# EAGLE schematic decel_control (EAGLE 9.6.2)
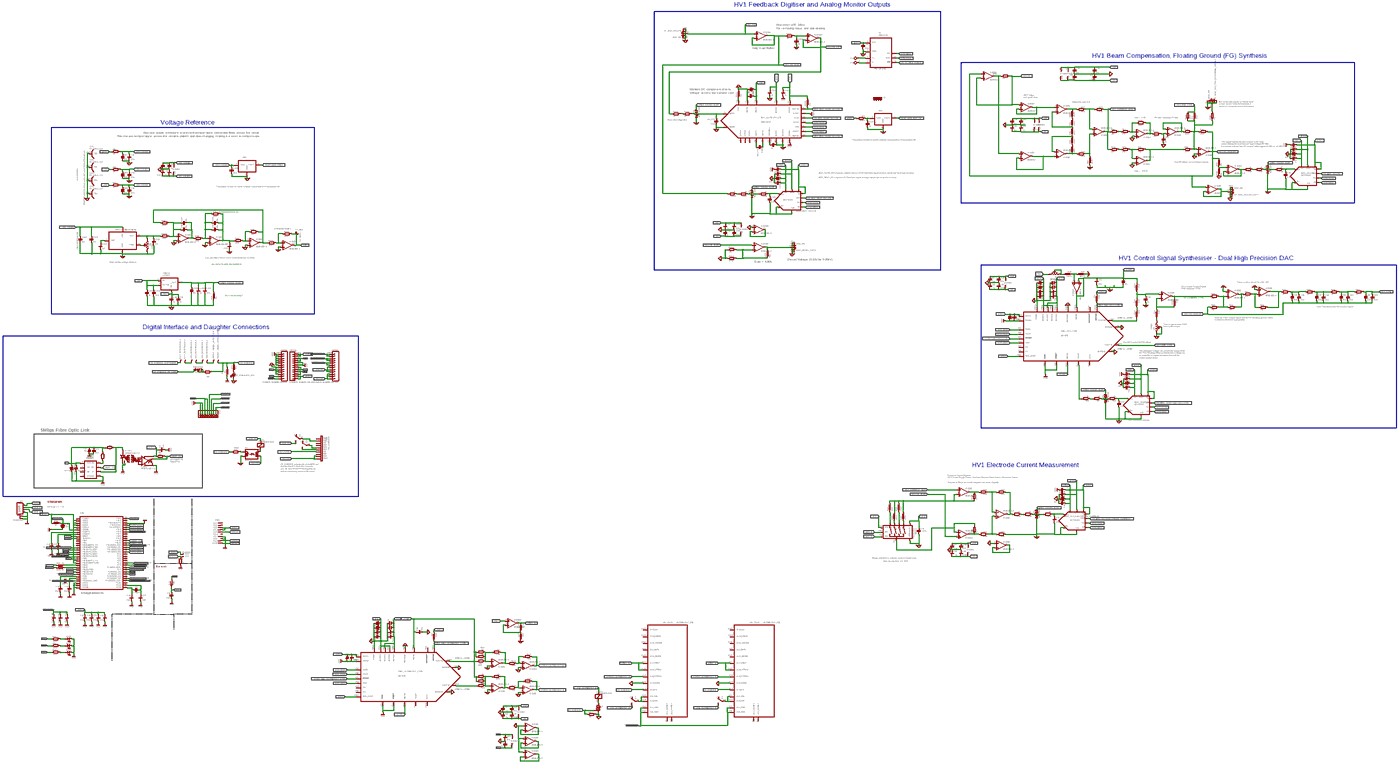
[diagram p0: schematic, sheet 1, overview]
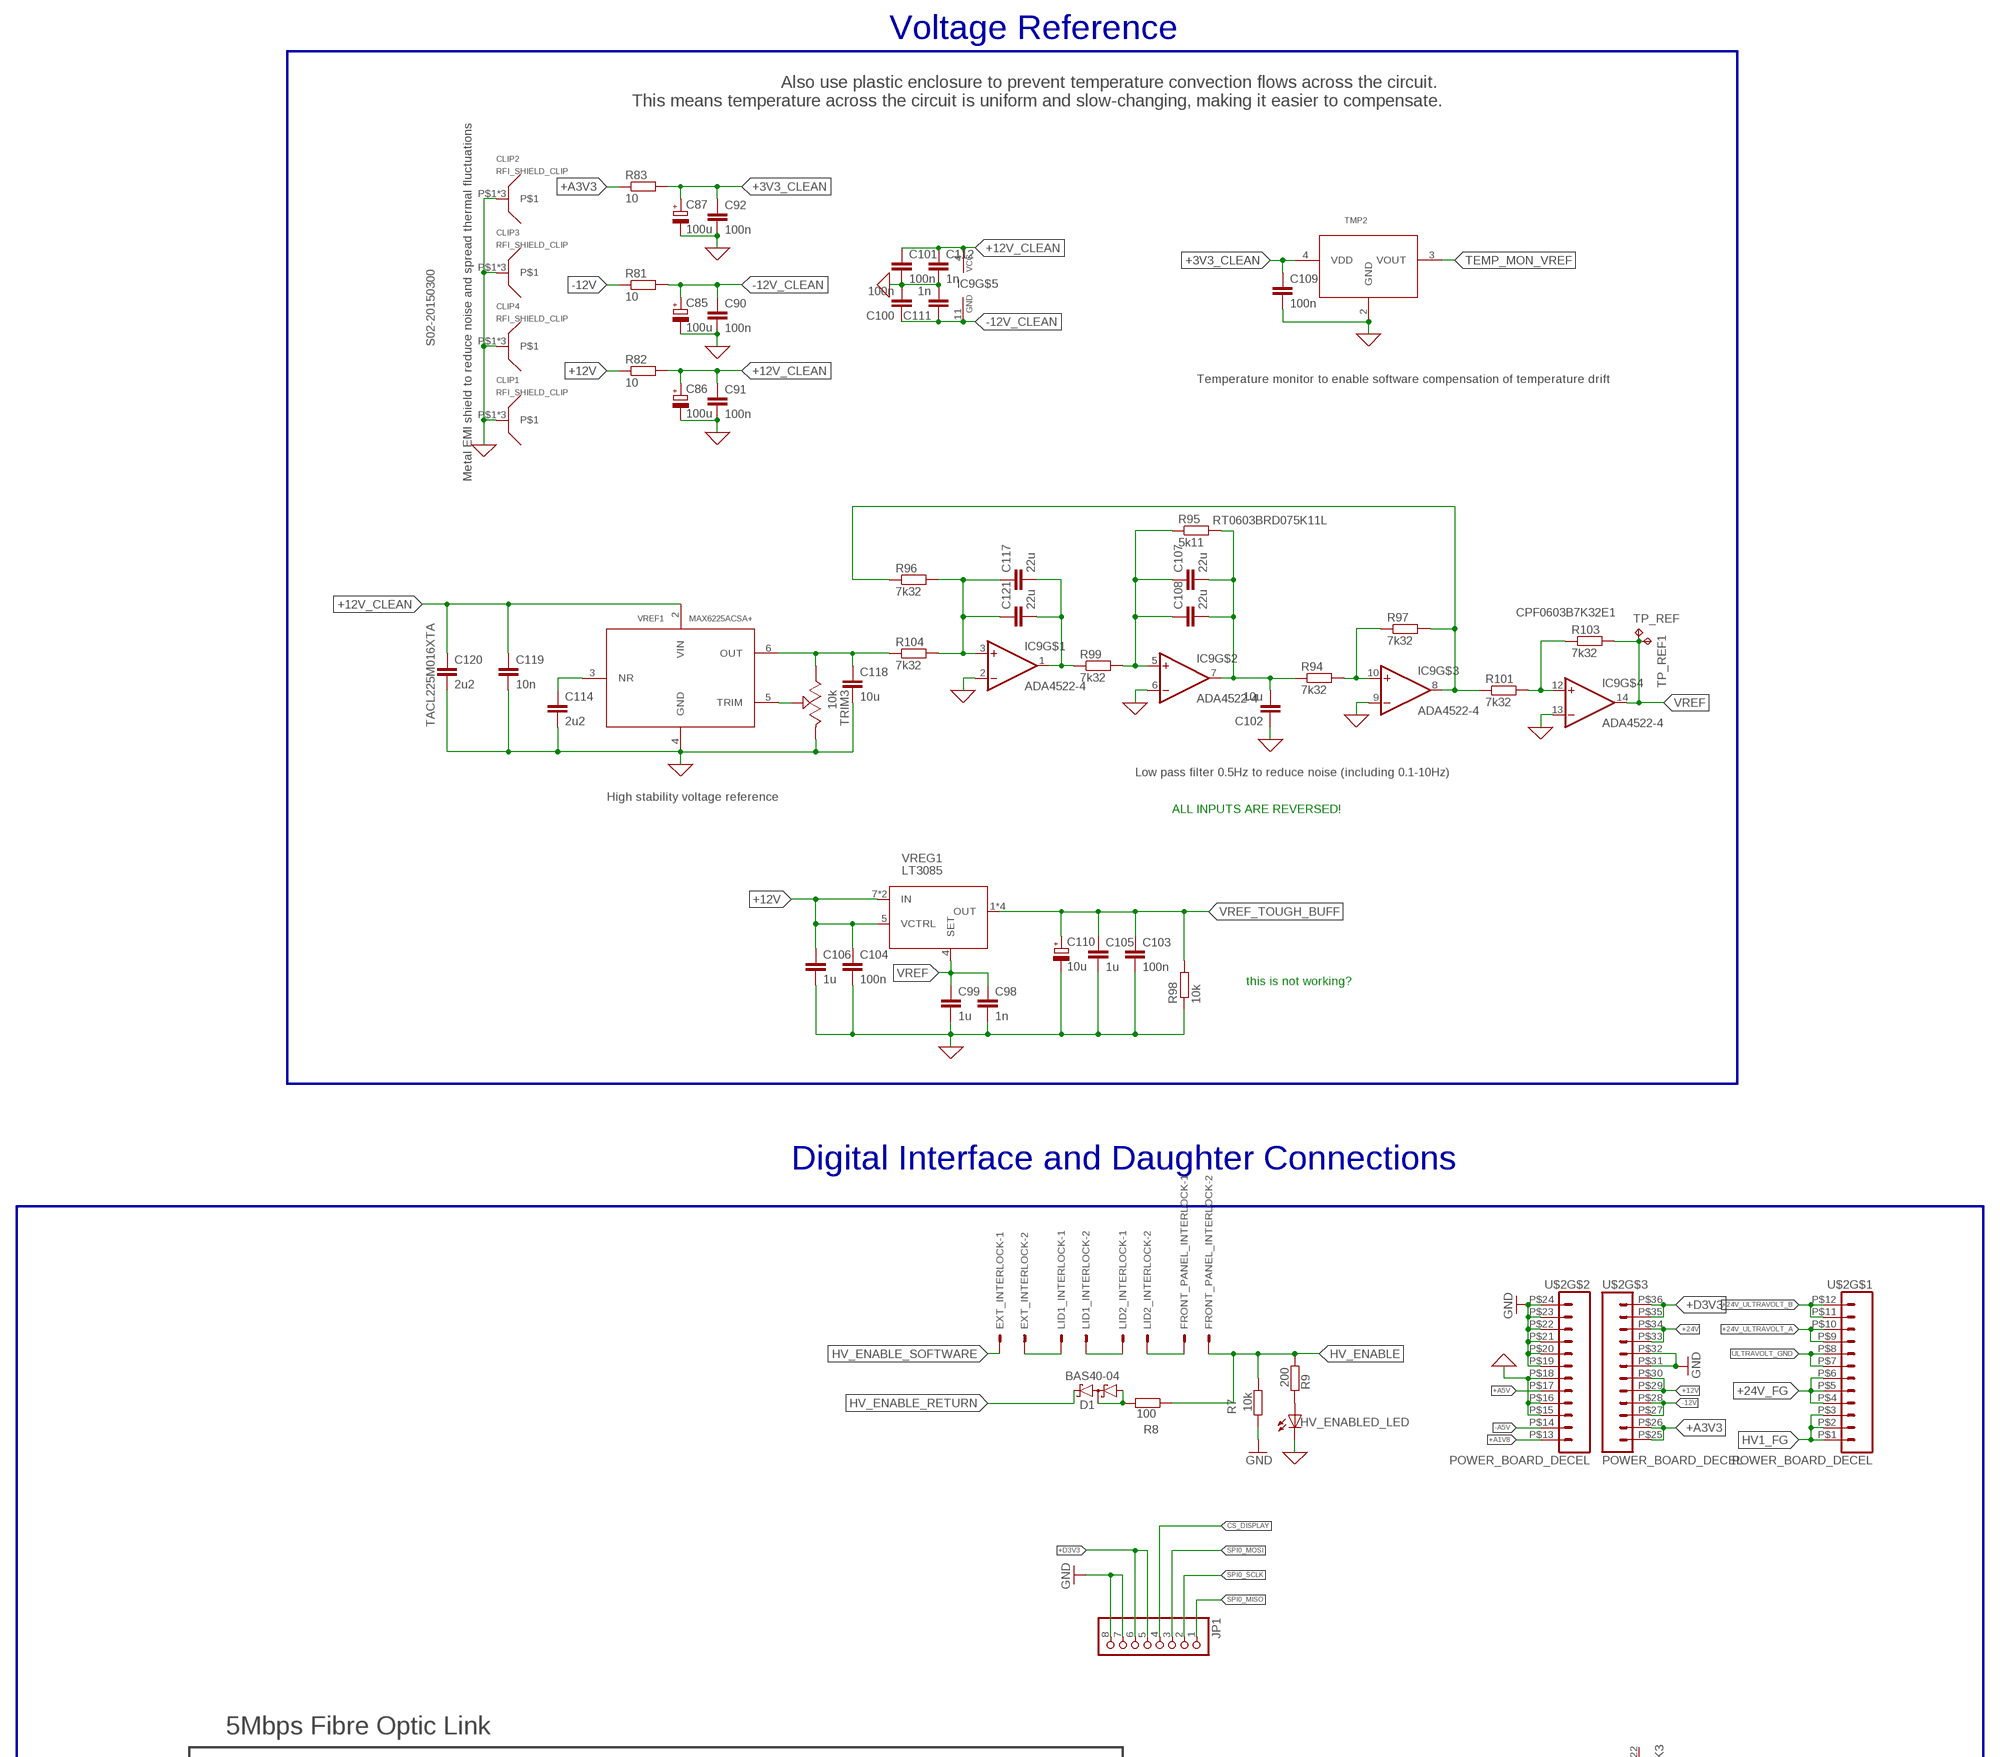
[diagram p1: schematic, sheet 1, part 1 of 7]
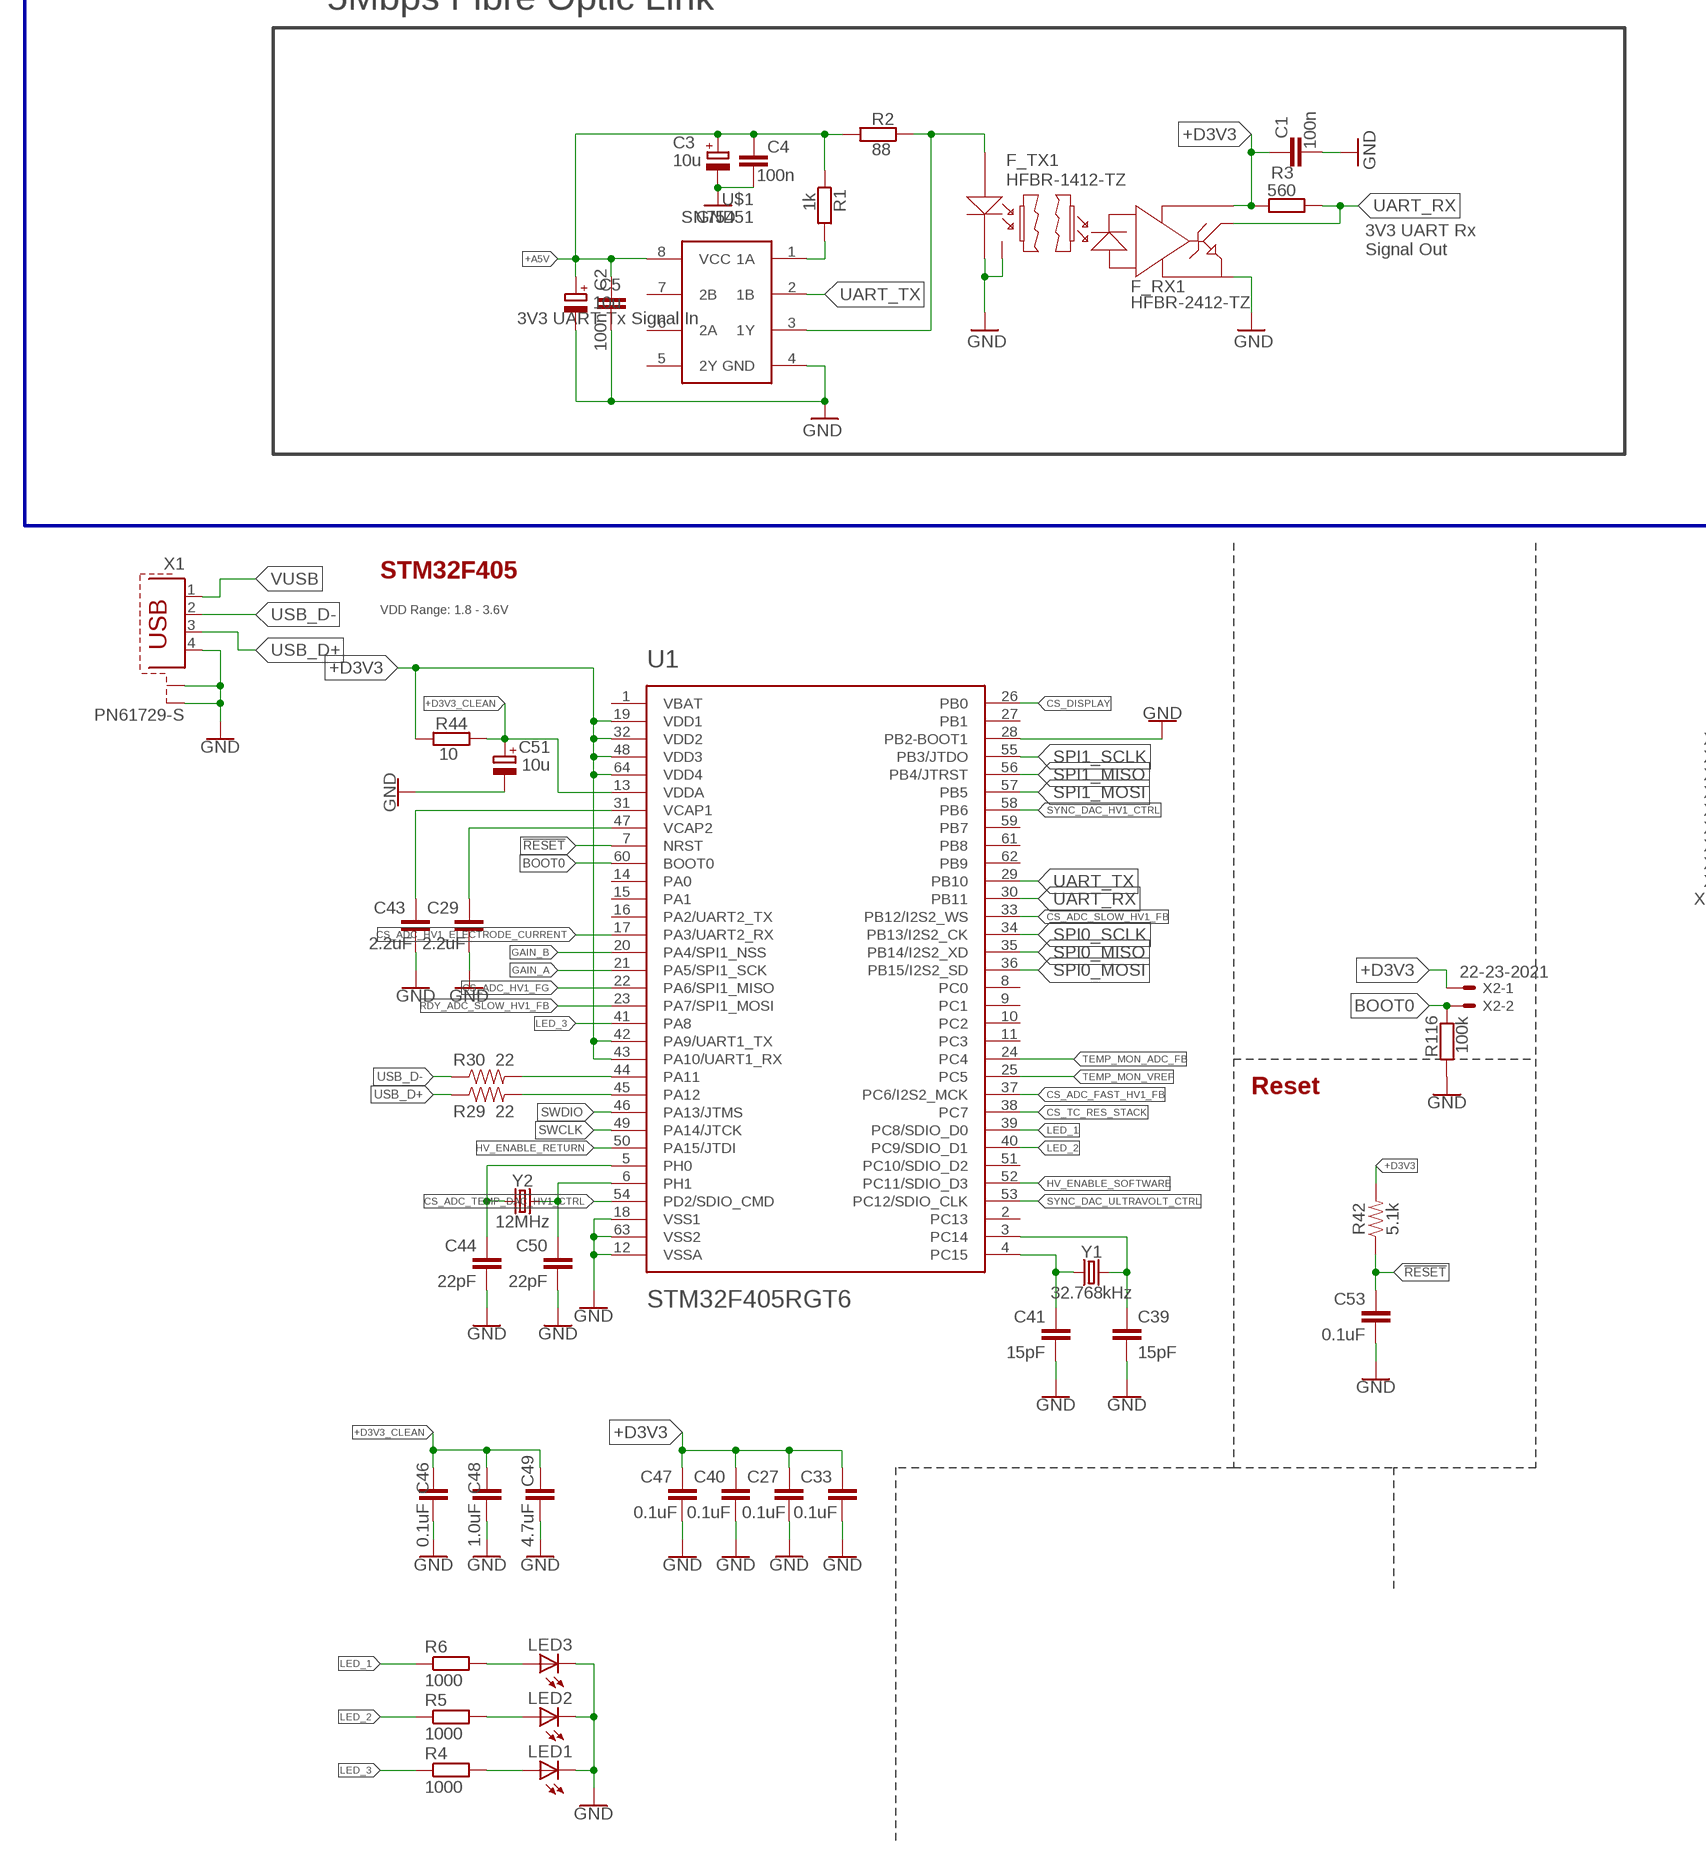
[diagram p2: schematic, sheet 1, part 2 of 7]
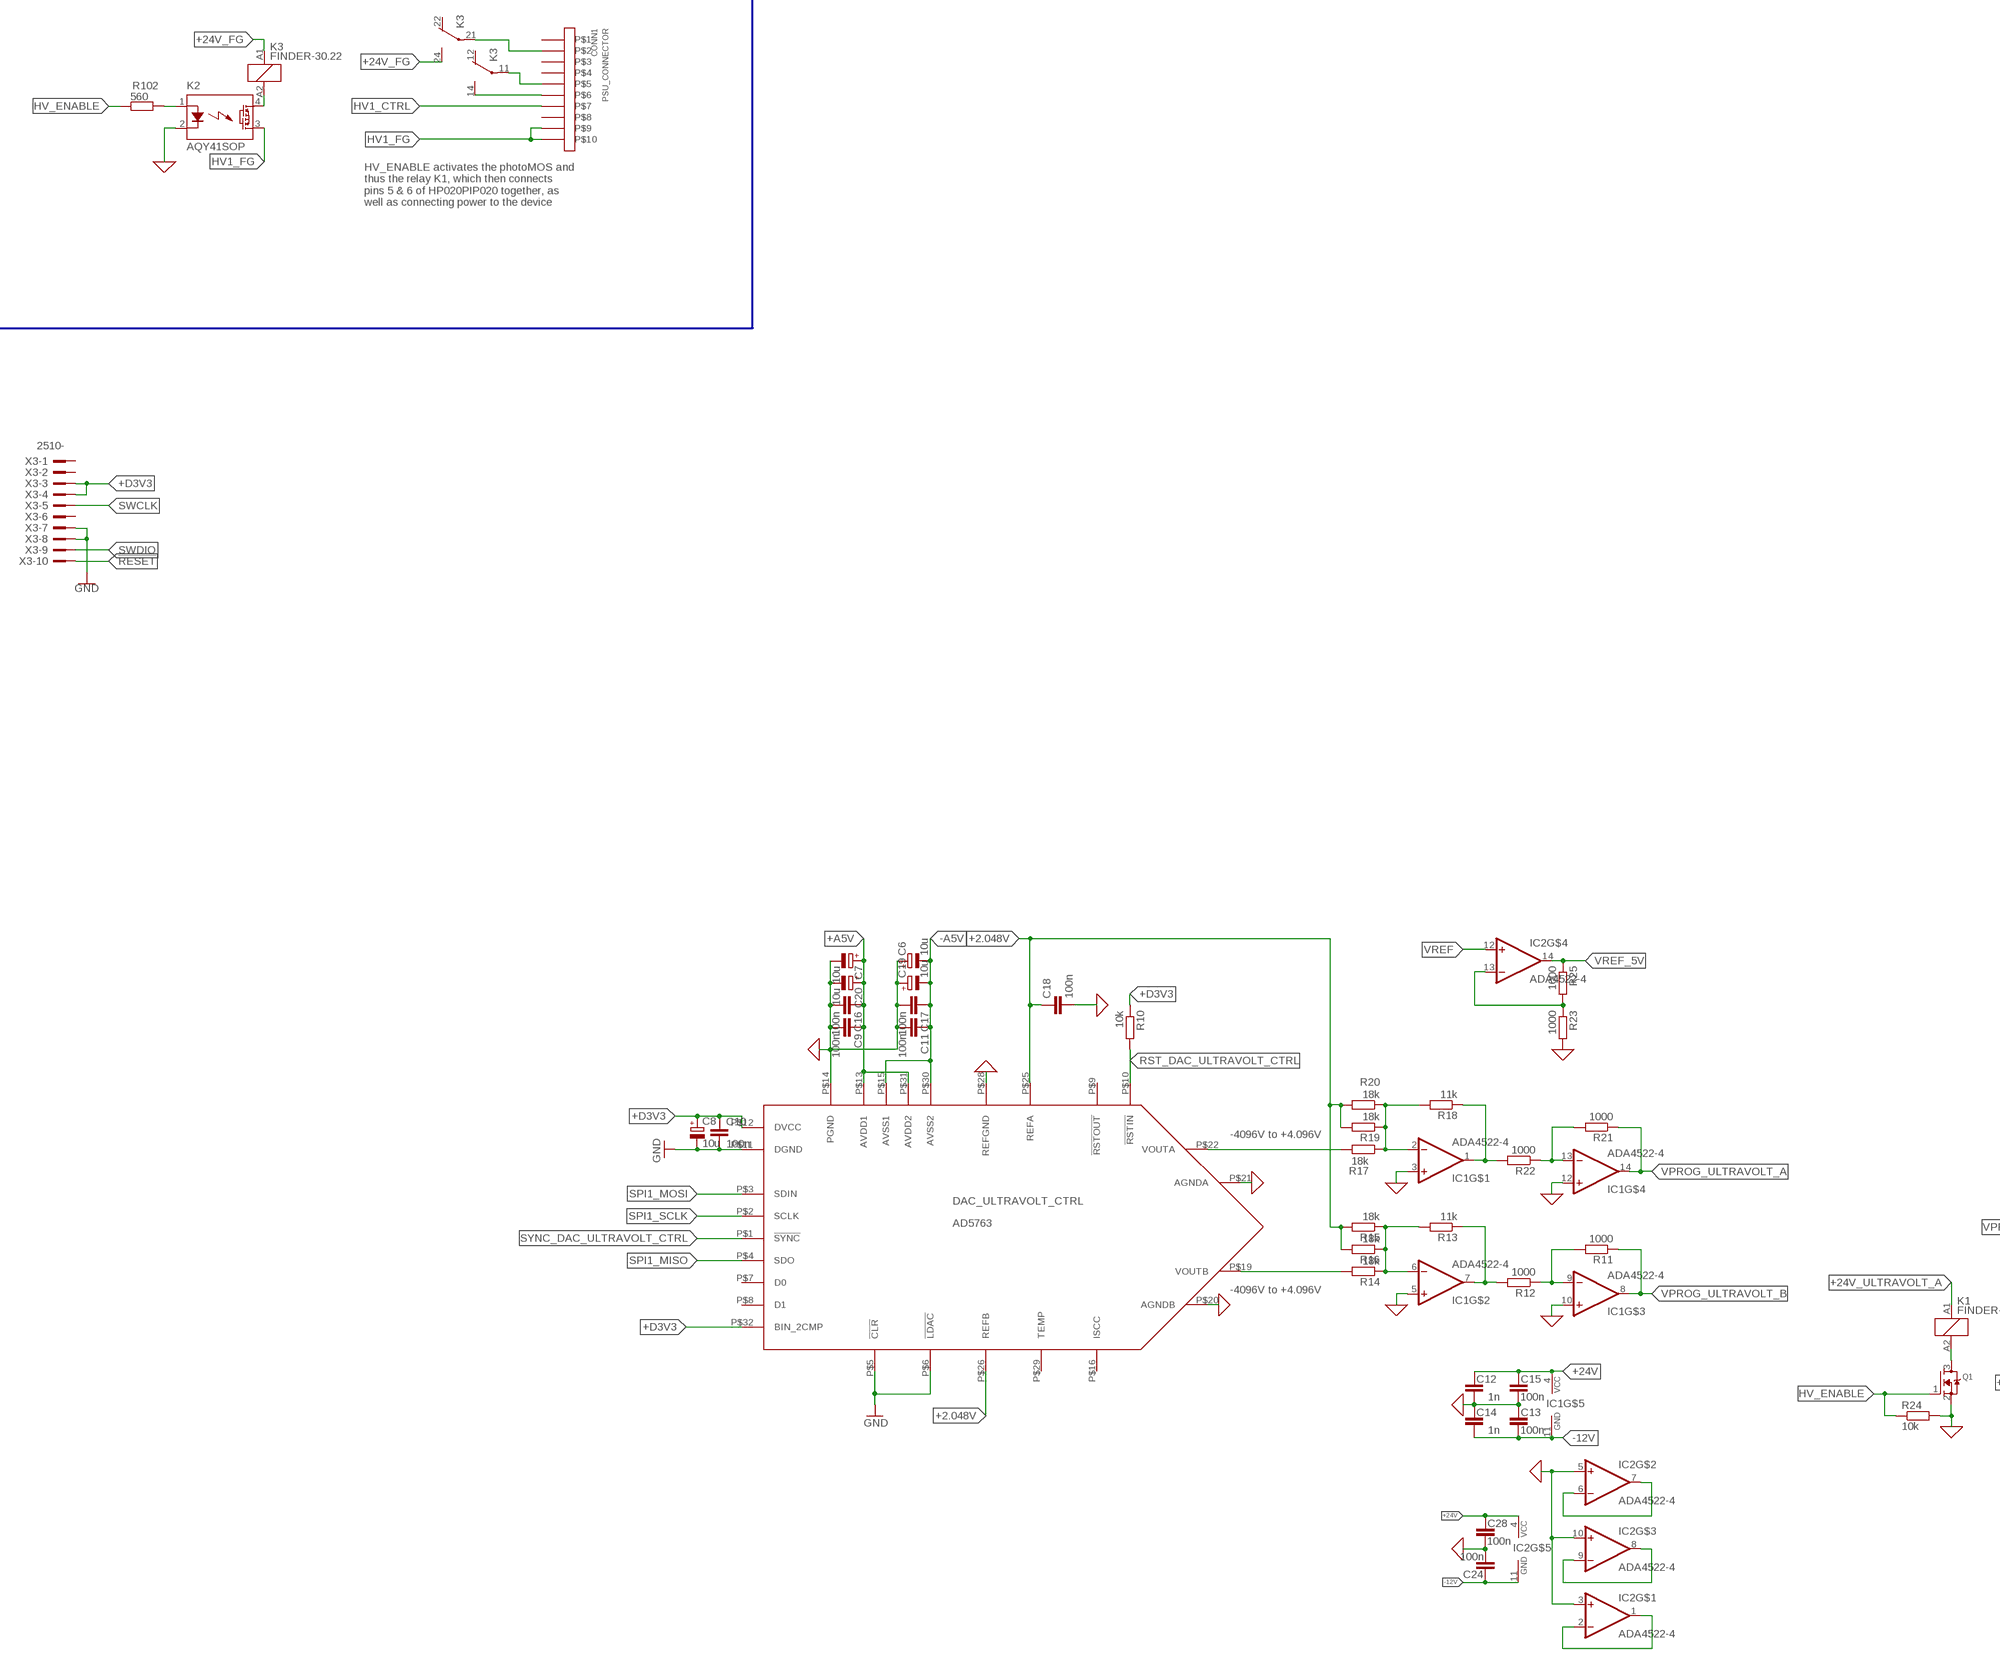
[diagram p3: schematic, sheet 1, part 3 of 7]
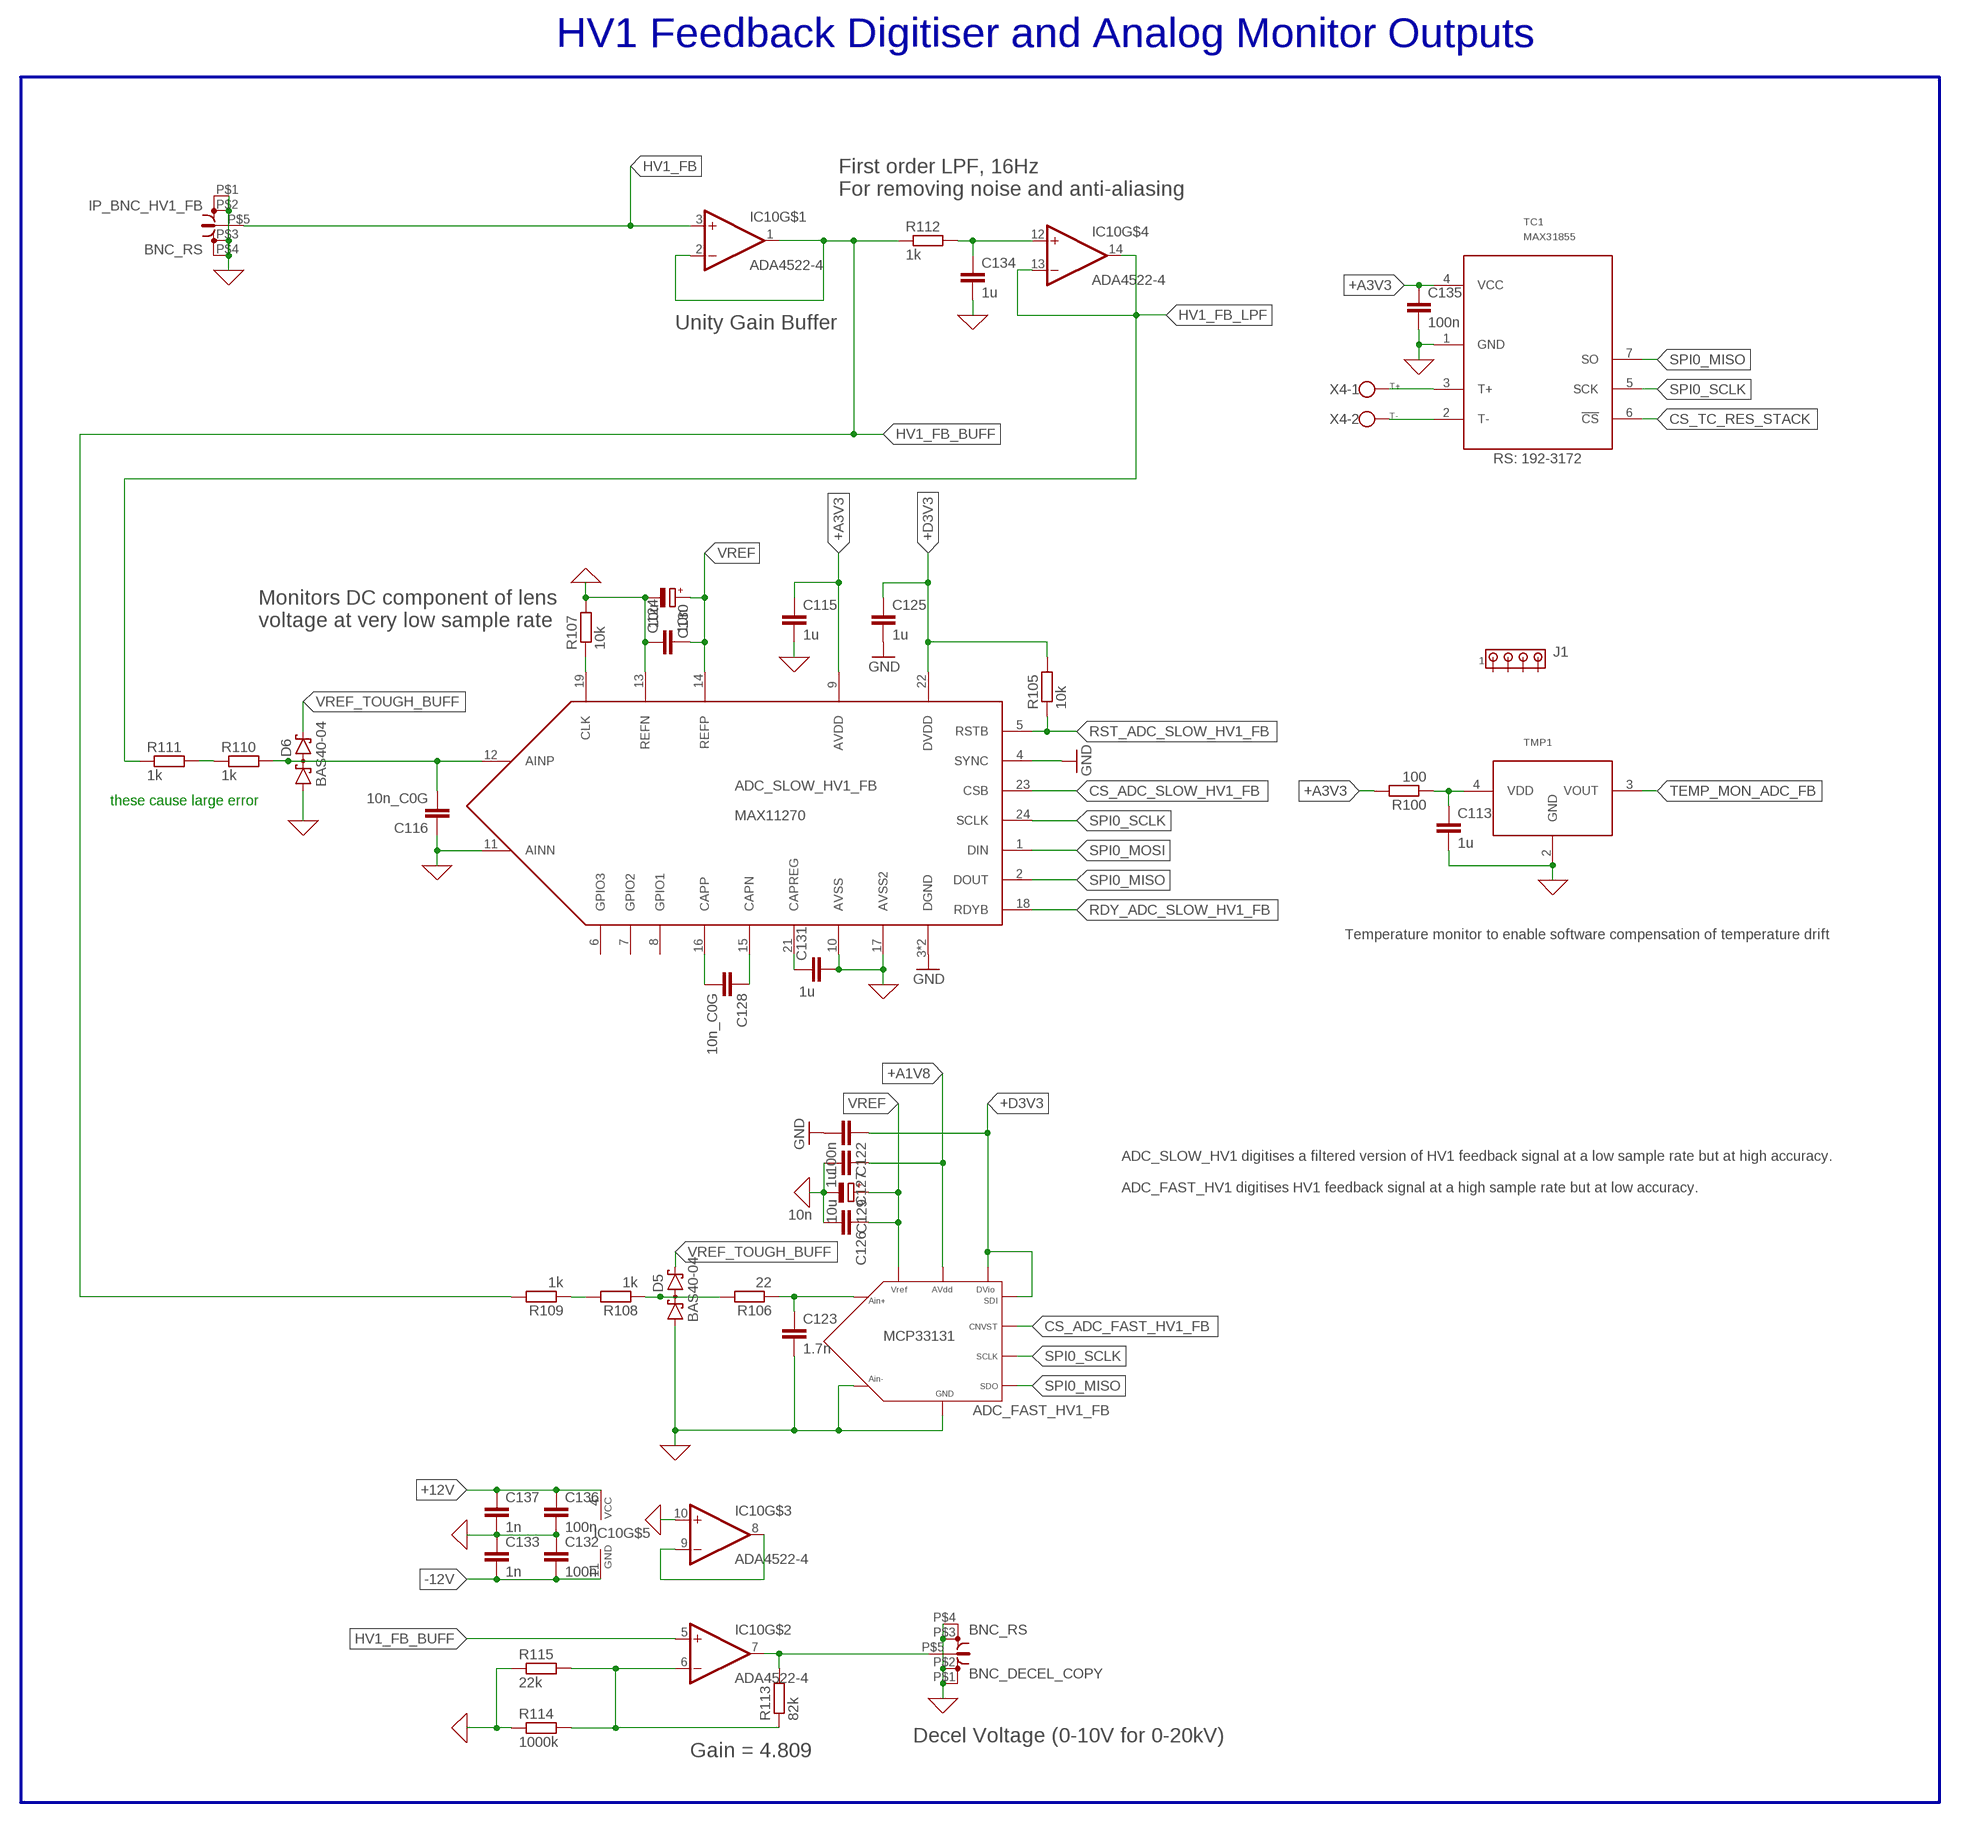
[diagram p4: schematic, sheet 1, part 4 of 7]
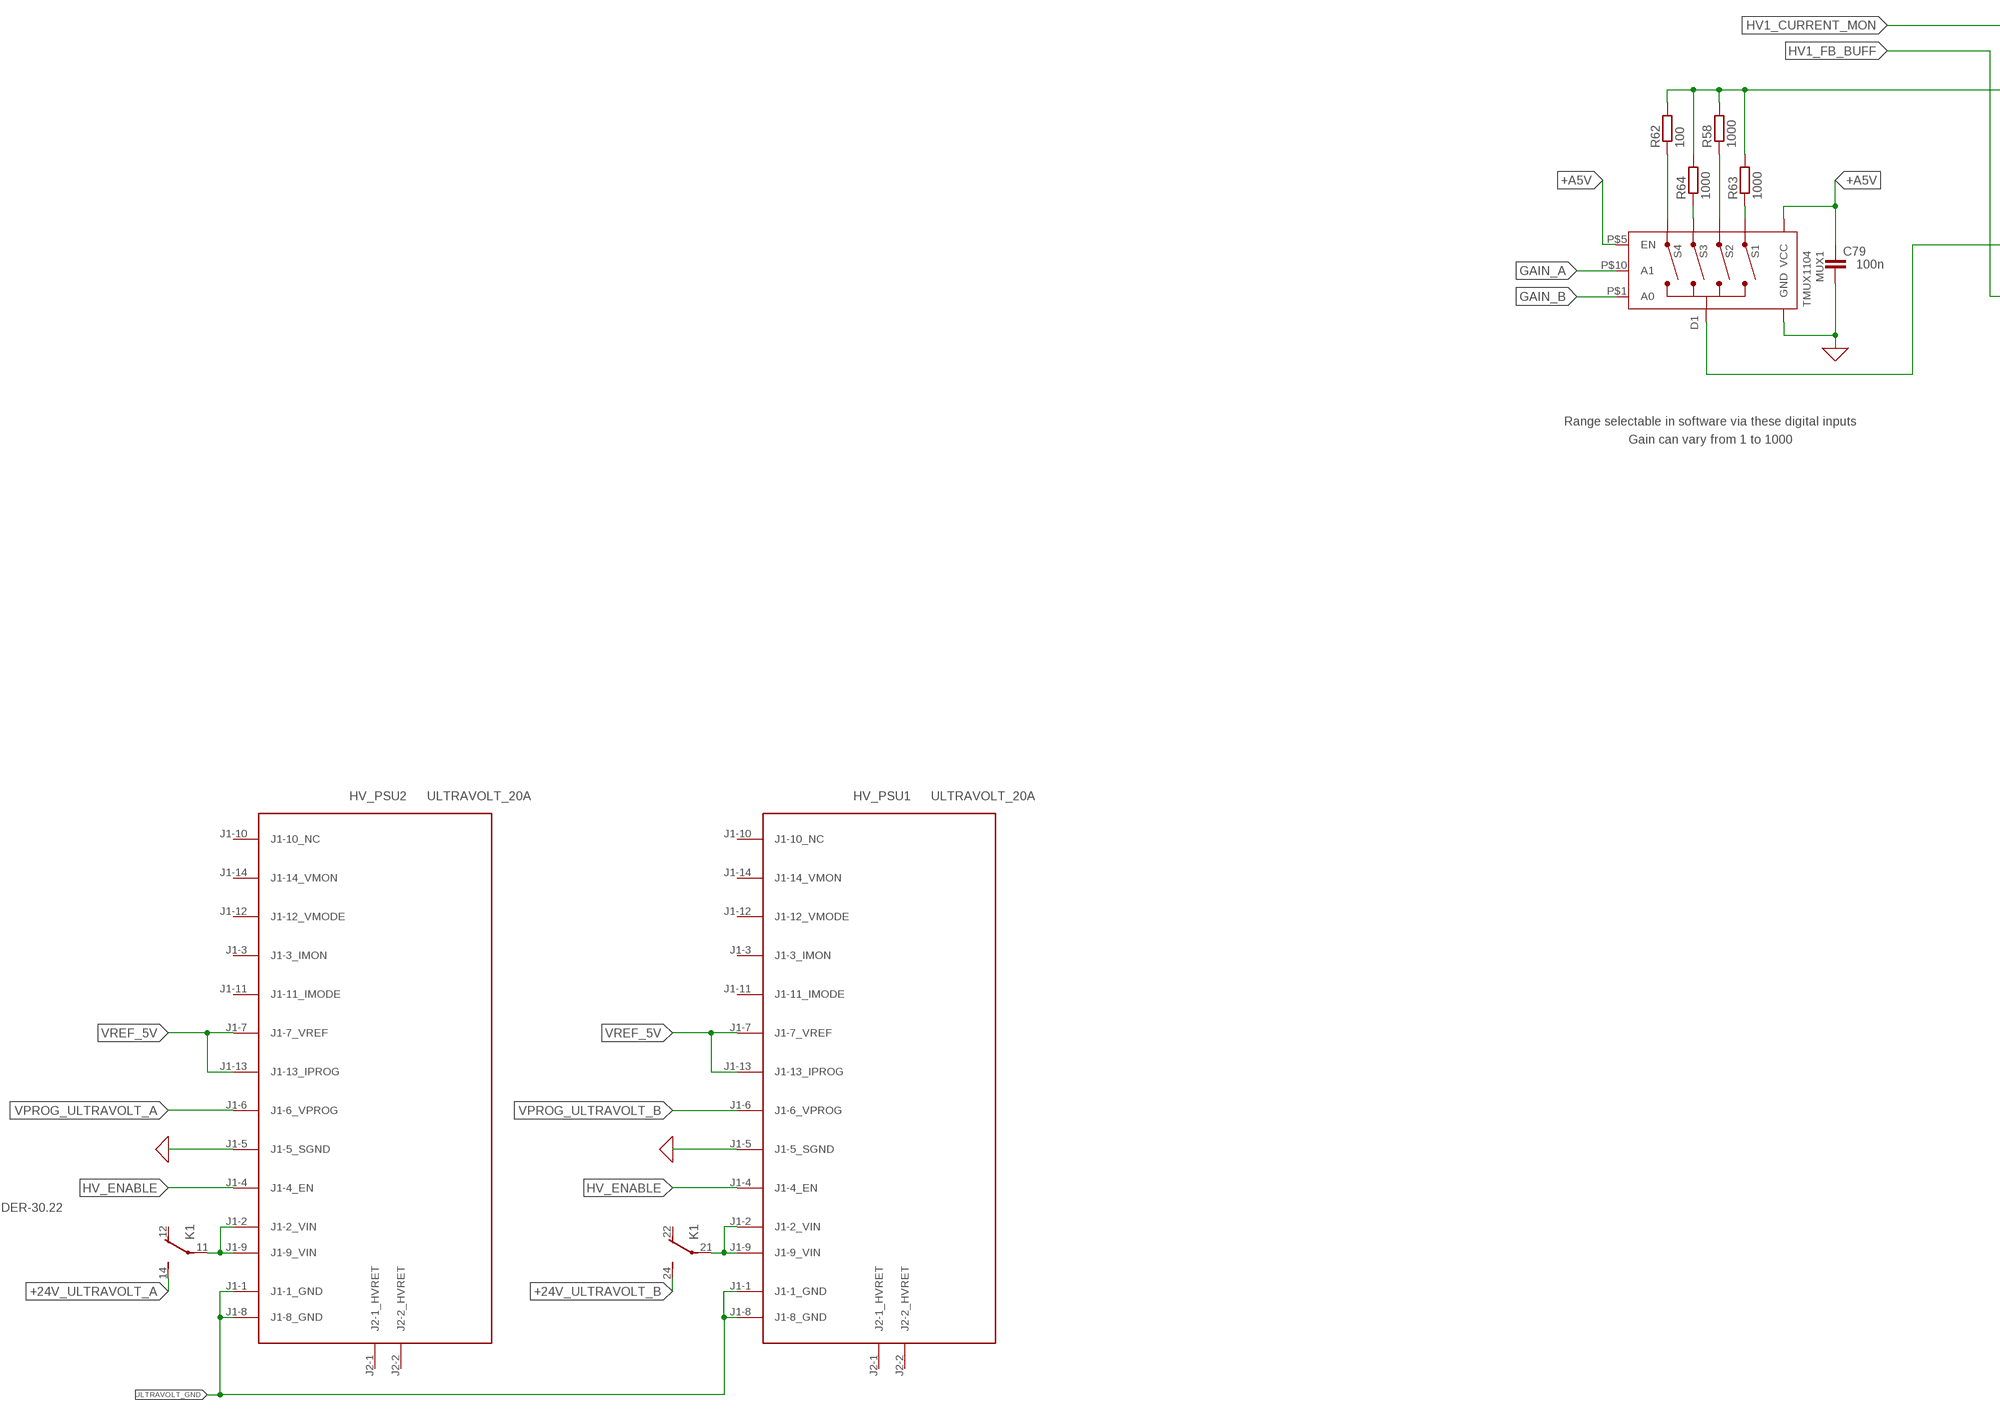
[diagram p5: schematic, sheet 1, part 5 of 7]
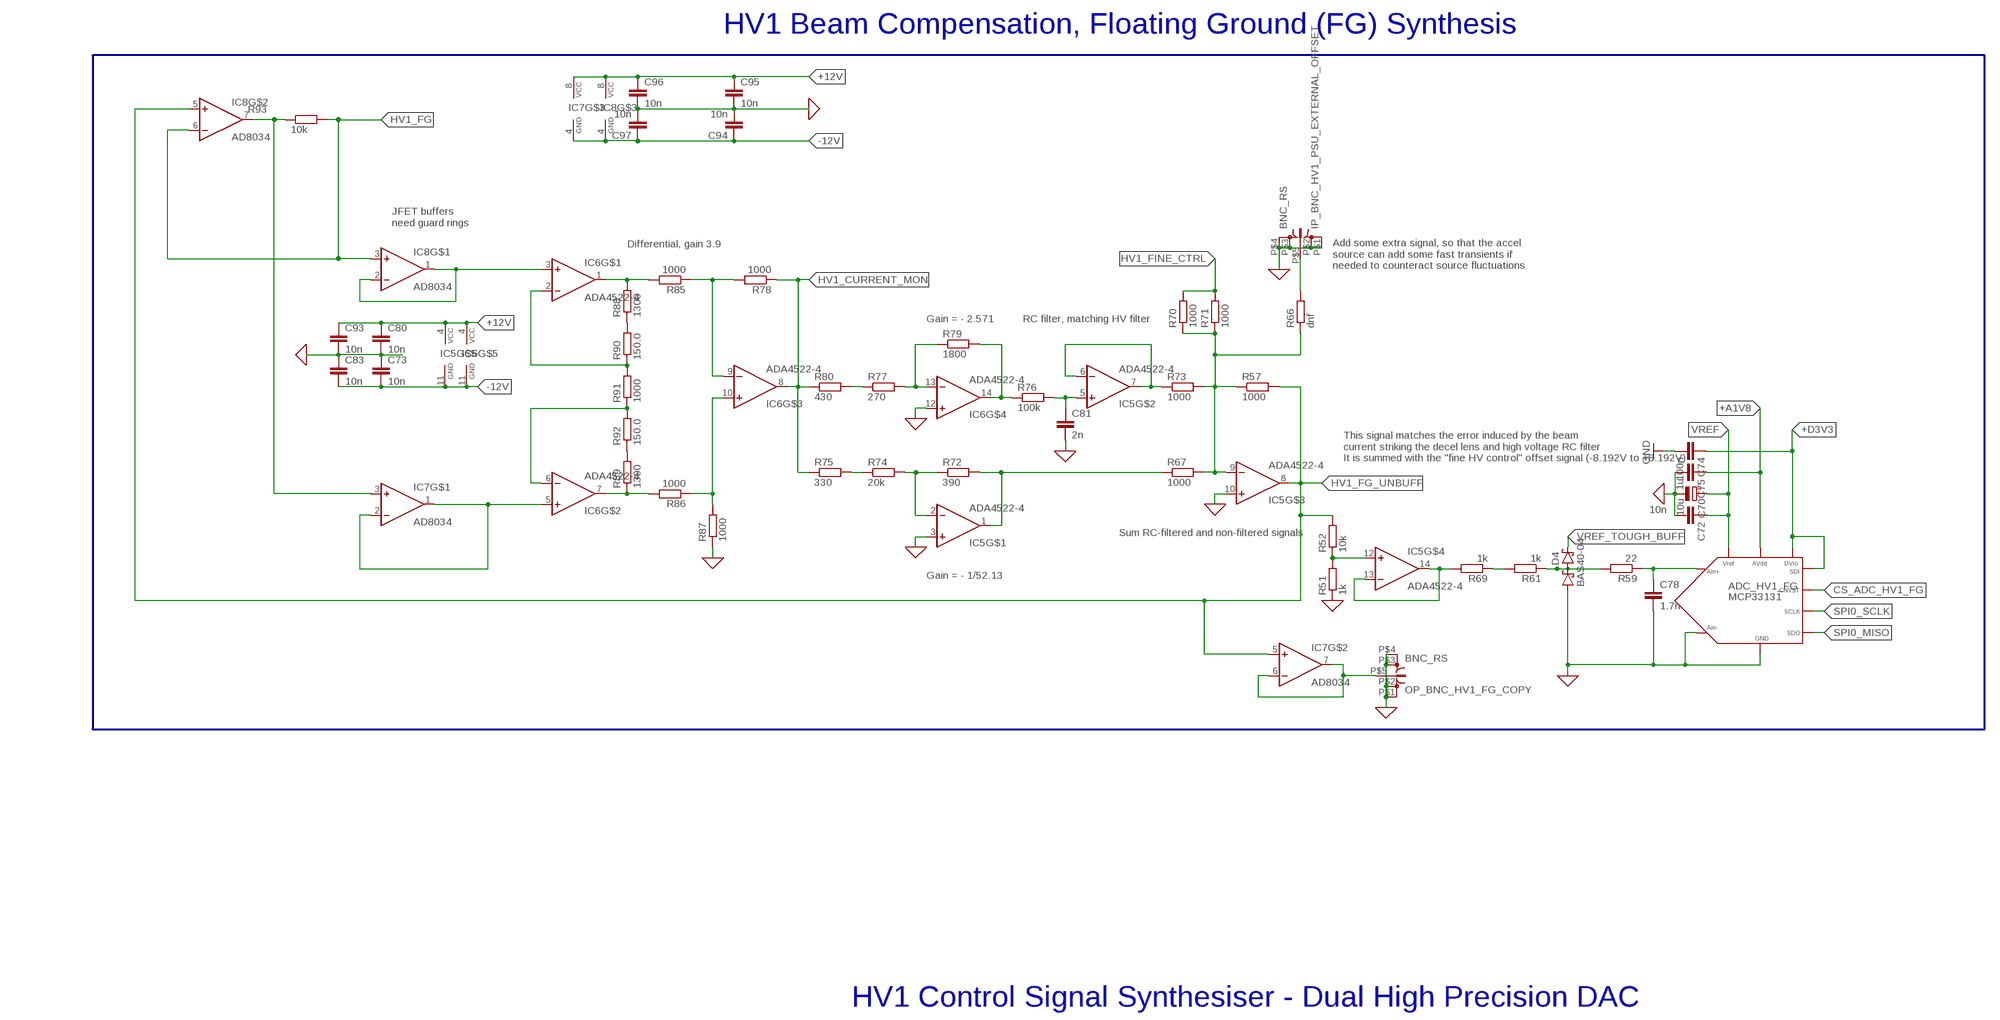
[diagram p6: schematic, sheet 1, part 6 of 7]
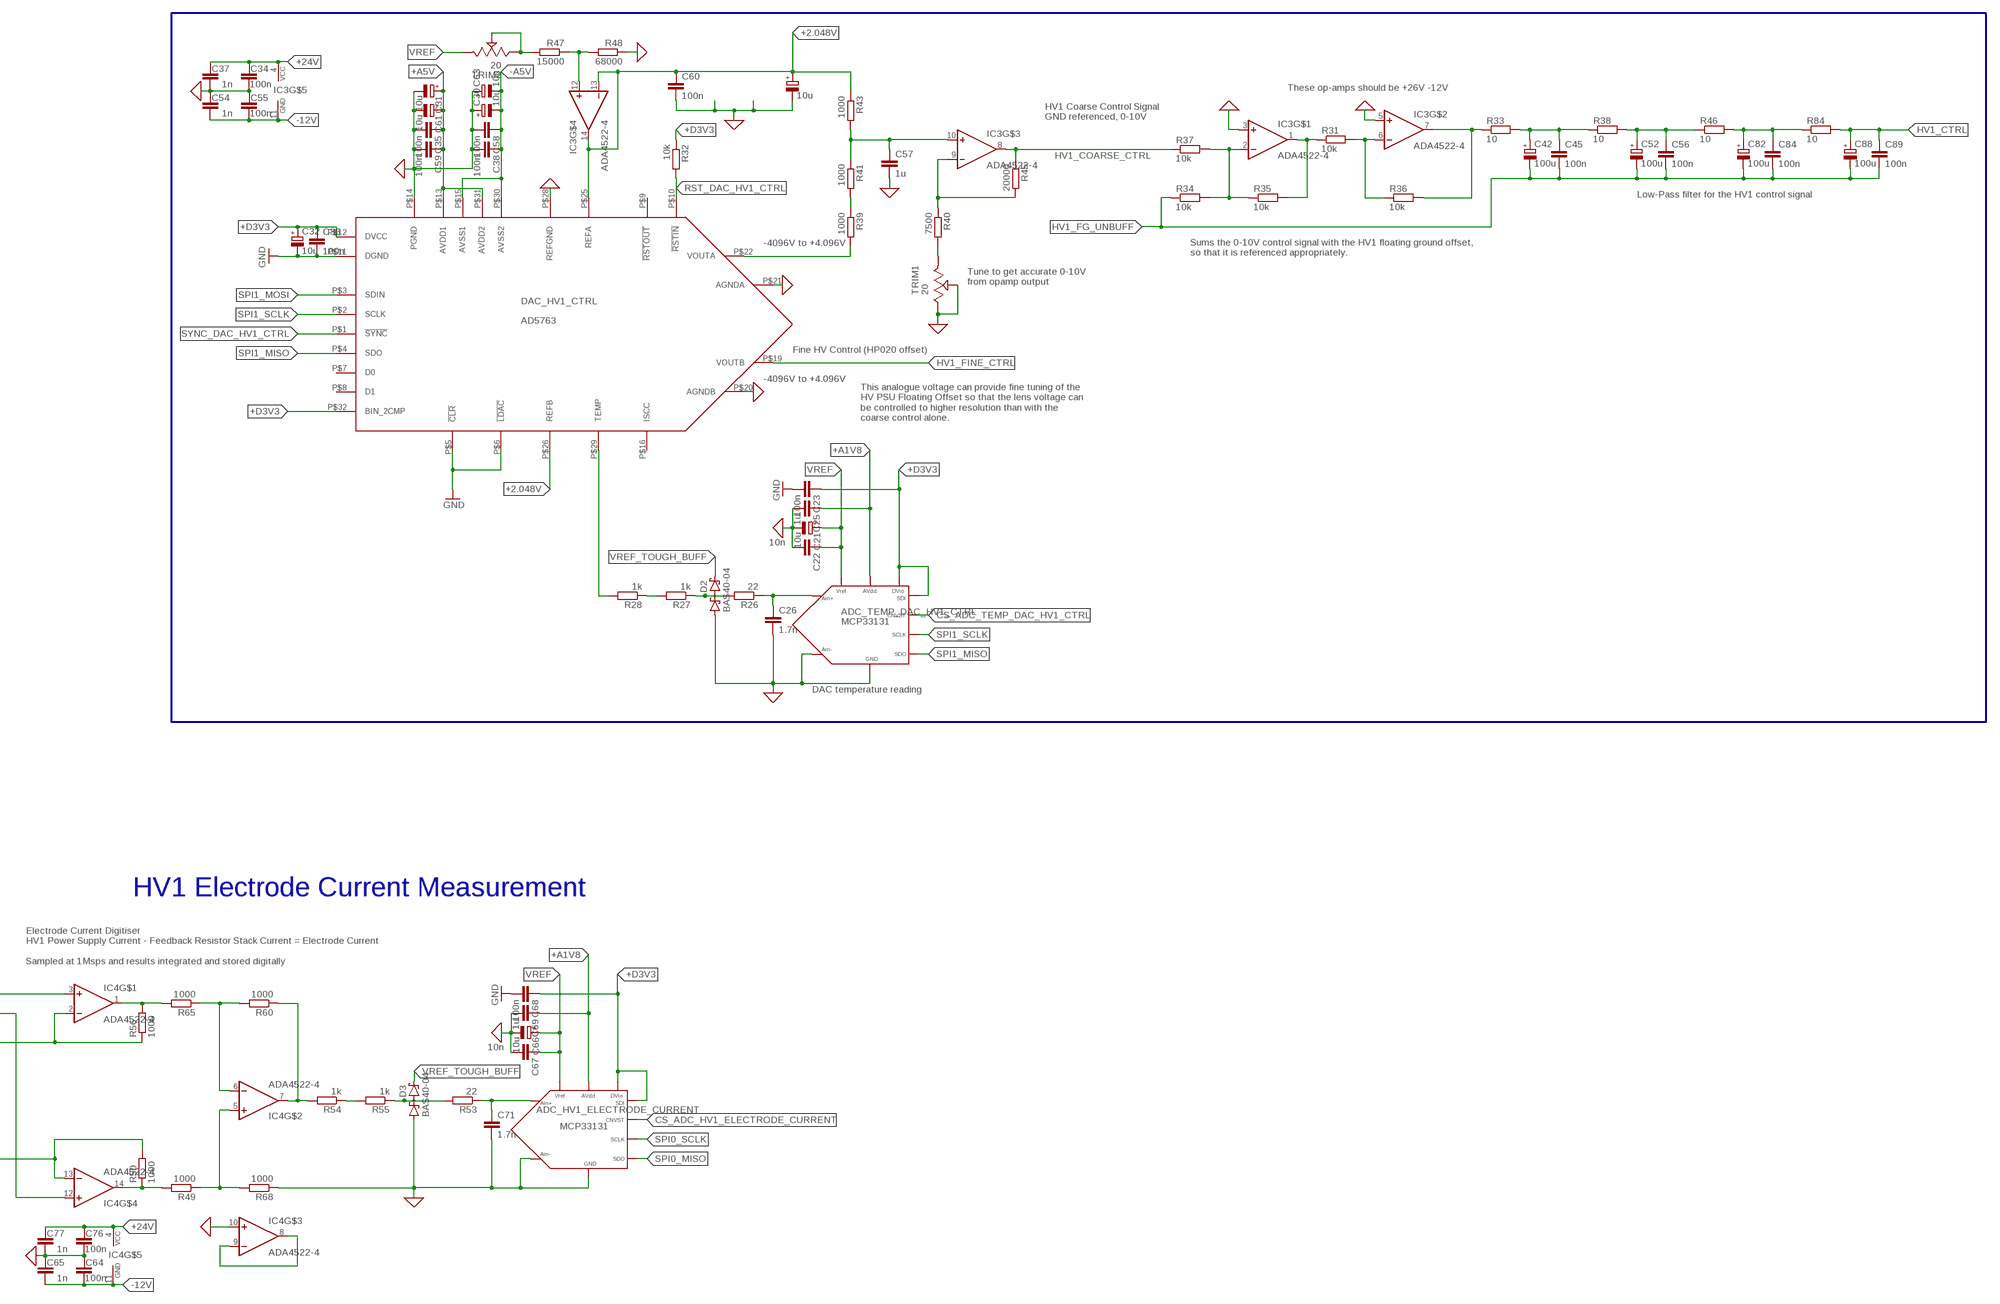
[diagram p7: schematic, sheet 1, part 7 of 7]

## Parts
ADC_FAST_HV1_FB  MCP33131  [MSOP10]
ADC_HV1_ELECTRODE_CURRENT  MCP33131  [MSOP10]
ADC_HV1_FG  MCP33131  [MSOP10]
ADC_SLOW_HV1_FB  MAX11270  [TSSOP24]
ADC_TEMP_DAC_HV1_CTRL  MCP33131  [MSOP10]
BNC_DECEL_COPY  BNC_RS  [BNC_RS]
C1  100n  C-EUC0805  [C0805]
C2  100n  C-EUC0805  [C0805]
C3  10u  CPOL-EUSMCB  [SMC_B]
C4  100n  C-EUC0805  [C0805]
C5  10u  CPOL-EUSMCB  [SMC_B]
C6  10u  CPOL-EUC/6032-28R  [C/6032-28R]
C7  10u  CPOL-EUC/6032-28R  [C/6032-28R]
C8  10u  CPOL-EUC/6032-28R  [C/6032-28R]
C9  100n  C-EUC0805  [C0805]
C10  100n  C-EUC0805  [C0805]
C11  100n  C-EUC0805  [C0805]
C12  1n  C-EUC0805  [C0805]
C13  100n  C-EUC0805  [C0805]
C14  1n  C-EUC0805  [C0805]
C15  100n  C-EUC0805  [C0805]
C16  100n  C-EUC0805  [C0805]
C17  100n  C-EUC0805  [C0805]
C18  100n  C-EUC0805  [C0805]
C19  10u  CPOL-EUC/6032-28R  [C/6032-28R]
C20  10u  CPOL-EUC/6032-28R  [C/6032-28R]
C21  10u  CPOL-EUC/6032-28R  [C/6032-28R]
C22  10n  C-EUC0805  [C0805]
C23  100n  C-EUC0805  [C0805]
C24  100n  C-EUC0805  [C0805]
C25  1u  C-EUC0805  [C0805]
C26  1.7n  C-EUC0805  [C0805]
C27  0.1uF  0.1UF-0402T-10V-10%-X7R  [0402-TIGHT]
C28  100n  C-EUC0805  [C0805]
C29  2.2uF  2.2UF-0402_TIGHT-10V-10%-X5R  [0402-TIGHT]
C30  10u  CPOL-EUC/6032-28R  [C/6032-28R]
C31  10u  CPOL-EUC/6032-28R  [C/6032-28R]
C32  10u  CPOL-EUC/6032-28R  [C/6032-28R]
C33  0.1uF  0.1UF-0402T-10V-10%-X7R  [0402-TIGHT]
C34  100n  C-EUC0805  [C0805]
C35  100n  C-EUC0805  [C0805]
C36  100n  C-EUC0805  [C0805]
C37  1n  C-EUC0805  [C0805]
C38  100n  C-EUC0805  [C0805]
C39  15pF  15PF-0402T-50V-5%  [0402-TIGHT]
C40  0.1uF  0.1UF-0402T-10V-10%-X7R  [0402-TIGHT]
C41  15pF  15PF-0402T-50V-5%  [0402-TIGHT]
C42  100u  CPOL-EUD/7343-31W  [D/7343-31W]
C43  2.2uF  2.2UF-0402_TIGHT-10V-10%-X5R  [0402-TIGHT]
C44  22pF  22PF-0402T-16V-10%  [0402-TIGHT]
C45  100n  C-EUC0805  [C0805]
C46  0.1uF  0.1UF-0402T-10V-10%-X7R  [0402-TIGHT]
C47  0.1uF  0.1UF-0402T-10V-10%-X7R  [0402-TIGHT]
C48  1.0uF  1.0UF-0402T-16V-10%  [0402-TIGHT]
C49  4.7uF  4.7UF-0402_TIGHT-6.3V-20%-X5R  [0402-TIGHT]
C50  22pF  22PF-0402T-16V-10%  [0402-TIGHT]
C51  10u  CPOL-EUSMCB  [SMC_B]
C52  100u  CPOL-EUD/7343-31W  [D/7343-31W]
C53  0.1uF  0.1UF-0402T-10V-10%-X7R  [0402-TIGHT]
C54  1n  C-EUC0805  [C0805]
C55  100n  C-EUC0805  [C0805]
C56  100n  C-EUC0805  [C0805]
C57  1u  C-EUC0805  [C0805]
C58  100n  C-EUC0805  [C0805]
C59  100n  C-EUC0805  [C0805]
C60  100n  C-EUC0805  [C0805]
C61  10u  CPOL-EUC/6032-28R  [C/6032-28R]
C62  10u  CPOL-EUC/6032-28R  [C/6032-28R]
C63  10u  CPOL-EUC/6032-28R  [C/6032-28R]
C64  100n  C-EUC0805  [C0805]
C65  1n  C-EUC0805  [C0805]
C66  10u  CPOL-EUC/6032-28R  [C/6032-28R]
C67  10n  C-EUC0805  [C0805]
C68  100n  C-EUC0805  [C0805]
C69  1u  C-EUC0805  [C0805]
C70  10u  CPOL-EUC/6032-28R  [C/6032-28R]
C71  1.7n  C-EUC0805  [C0805]
C72  10n  C-EUC0805  [C0805]
C73  10n  C-EUC0805  [C0805]
C74  100n  C-EUC0805  [C0805]
C75  1u  C-EUC0805  [C0805]
C76  100n  C-EUC0805  [C0805]
C77  1n  C-EUC0805  [C0805]
C78  1.7n  C-EUC0805  [C0805]
C79  100n  C-EUC0805  [C0805]
C80  10n  C-EUC0805  [C0805]
C81  2n  C-EUC0805  [C0805]
C82  100u  CPOL-EUD/7343-31W  [D/7343-31W]
C83  10n  C-EUC0805  [C0805]
C84  100n  C-EUC0805  [C0805]
C85  100u  CPOL-EUD/7343-31W  [D/7343-31W]
C86  100u  CPOL-EUD/7343-31W  [D/7343-31W]
C87  100u  CPOL-EUD/7343-31W  [D/7343-31W]
C88  100u  CPOL-EUD/7343-31W  [D/7343-31W]
C89  100n  C-EUC0805  [C0805]
C90  100n  C-EUC0805  [C0805]
C91  100n  C-EUC0805  [C0805]
C92  100n  C-EUC0805  [C0805]
C93  10n  C-EUC0805  [C0805]
C94  10n  C-EUC0805  [C0805]
C95  10n  C-EUC0805  [C0805]
C96  10n  C-EUC0805  [C0805]
C97  10n  C-EUC0805  [C0805]
C98  1n  C-EUC0805  [C0805]
C99  1u  C-EUC0805  [C0805]
C100  100n  C-EUC0603  [C0603]
C101  100n  C-EUC0603  [C0603]
C102  10u  C-EUC0603  [C0603]
C103  100n  C-EUC0805  [C0805]
C104  100n  C-EUC0805  [C0805]
C105  1u  C-EUC0805  [C0805]
C106  1u  C-EUC0805  [C0805]
C107  22u  C-EUC0603  [C0603]
C108  22u  C-EUC0603  [C0603]
C109  100n  C-EUC0805  [C0805]
C110  10u  CPOL-EUC/6032-28R  [C/6032-28R]
C111  1n  C-EUC0603  [C0603]
C112  1n  C-EUC0603  [C0603]
C113  1u  C-EUC0805  [C0805]
C114  2u2  C-EUC0603  [C0603]
C115  1u  C-EUC0805  [C0805]
C116  10n_C0G  C-EUC0805  [C0805]
C117  22u  C-EUC0603  [C0603]
C118  10u  C-EUC0603  [C0603]
C119  10n  C-EUC0603  [C0603]
C120  2u2  C-EUC0603  [C0603]
C121  22u  C-EUC0603  [C0603]
C122  100n  C-EUC0805  [C0805]
C123  1.7n  C-EUC0805  [C0805]
C124  10n  C-EUC0805  [C0805]
C125  1u  C-EUC0805  [C0805]
C126  10n  C-EUC0805  [C0805]
C127  1u  C-EUC0805  [C0805]
C128  10n_C0G  C-EUC0805  [C0805]
C129  10u  CPOL-EUC/6032-28R  [C/6032-28R]
C130  10u  CPOL-EUC/6032-28R  [C/6032-28R]
C131  1u  C-EUC0805  [C0805]
C132  100n  C-EUC0805  [C0805]
C133  1n  C-EUC0805  [C0805]
C134  1u  C-EUC0805  [C0805]
C135  100n  C-EUC0805  [C0805]
C136  100n  C-EUC0805  [C0805]
C137  1n  C-EUC0805  [C0805]
CLIP1  RFI_SHIELD_CLIP  [RFI_SHIELD_CLIP]
CLIP2  RFI_SHIELD_CLIP  [RFI_SHIELD_CLIP]
CLIP3  RFI_SHIELD_CLIP  [RFI_SHIELD_CLIP]
CLIP4  RFI_SHIELD_CLIP  [RFI_SHIELD_CLIP]
CONN1  PSU_CONNECTOR  [PSU_CONNECTION]
D1  BAS40-04  [SOT23]
D2  BAS40-04  [SOT23]
D3  BAS40-04  [SOT23]
D4  BAS40-04  [SOT23]
D5  BAS40-04  [SOT23]
D6  BAS40-04  [SOT23]
DAC_HV1_CTRL  AD5763  [TQFP-32]
DAC_ULTRAVOLT_CTRL  AD5763  [TQFP-32]
EXT_INTERLOCK  KK-156-2  [KK-156-2]
F_RX1  HFBR-2412-TZ  [HFBR-X41XZ]
F_TX1  HFBR-1412-TZ  [HFBR-X41XZ]
FRONT_PANEL_INTERLOCK  KK-156-2  [KK-156-2]
HV_ENABLED_LED  LEDCHIPLED_0805  [CHIPLED_0805]
HV_PSU1  ULTRAVOLT_20A  [ULTRAVOLT_20A]
HV_PSU2  ULTRAVOLT_20A  [ULTRAVOLT_20A]
IC1  ADA4522-4  [SO14]
IC2  ADA4522-4  [SO14]
IC3  ADA4522-4  [SO14]
IC4  ADA4522-4  [SO14]
IC5  ADA4522-4  [SO14]
IC6  ADA4522-4  [SO14]
IC7  AD8034  [SOIC8]
IC8  AD8034  [SOIC8]
IC9  ADA4522-4  [SO14]
IC10  ADA4522-4  [SO14]
IP_BNC_HV1_FB  BNC_RS  [BNC_RS]
IP_BNC_HV1_PSU_EXTERNAL_OFFSET  BNC_RS  [BNC_RS]
J1  MTA04-156  [1X4MTA]
JP1  PINHD-1X8-3.5MM  [1X08-3.5MM]
K1  FINDER-30.22  [FINDER-30.22]
K2  AQY41SOP  [SOP04]
K3  FINDER-30.22  [FINDER-30.22]
LED1  LEDCHIP-LED0805  [CHIP-LED0805]
LED2  LEDCHIP-LED0805  [CHIP-LED0805]
LED3  LEDCHIP-LED0805  [CHIP-LED0805]
LID1_INTERLOCK  KK-156-2  [KK-156-2]
LID2_INTERLOCK  KK-156-2  [KK-156-2]
MUX1  TMUX1104  [VSSOP-10]
OP_BNC_HV1_FG_COPY  BNC_RS  [BNC_RS]
Q1  MOSFET-NREFLOW  [SOT23]
R1  1k  R-EU_R0805  [R0805]
R2  88  R-EU_R0805  [R0805]
R3  560  R-EU_R0805  [R0805]
R4  1000  R-EU_R0805  [R0805]
R5  1000  R-EU_R0805  [R0805]
R6  1000  R-EU_R0805  [R0805]
R7  10k  R-EU_R0805  [R0805]
R8  100  R-EU_R0805  [R0805]
R9  200  R-EU_R0805  [R0805]
R10  10k  R-EU_R0805  [R0805]
R11  1000  R-EU_R0805  [R0805]
R12  1000  R-EU_R0805  [R0805]
R13  11k  R-EU_R0805  [R0805]
R14  18k  R-EU_R0805  [R0805]
R15  18k  R-EU_R0805  [R0805]
R16  18k  R-EU_R0805  [R0805]
R17  18k  R-EU_R0805  [R0805]
R18  11k  R-EU_R0805  [R0805]
R19  18k  R-EU_R0805  [R0805]
R20  18k  R-EU_R0805  [R0805]
R21  1000  R-EU_R0805  [R0805]
R22  1000  R-EU_R0805  [R0805]
R23  1000  R-EU_R0805  [R0805]
R24  10k  R-EU_R0805  [R0805]
R25  1000  R-EU_R0805  [R0805]
R26  22  R-EU_R0805  [R0805]
R27  1k  R-EU_R0805  [R0805]
R28  1k  R-EU_R0805  [R0805]
R29  22  22OHM-0402T-1/16W-1%  [0402-TIGHT]
R30  22  22OHM-0402T-1/16W-1%  [0402-TIGHT]
R31  10k  R-EU_R0805  [R0805]
R32  10k  R-EU_R0805  [R0805]
R33  10  R-EU_R0805  [R0805]
R34  10k  R-EU_R0805  [R0805]
R35  10k  R-EU_R0805  [R0805]
R36  10k  R-EU_R0805  [R0805]
R37  10k  R-EU_R0805  [R0805]
R38  10  R-EU_R0805  [R0805]
R39  1000  R-EU_R0805  [R0805]
R40  7500  R-EU_R0805  [R0805]
R41  1000  R-EU_R0805  [R0805]
R42  5.1k  5.1KOHM-0402T-1/16W-1%  [0402-TIGHT]
R43  1000  R-EU_R0805  [R0805]
R44  10  R-EU_R0805  [R0805]
R45  20000  R-EU_R0805  [R0805]
R46  10  R-EU_R0805  [R0805]
R47  15000  R-EU_R0805  [R0805]
R48  68000  R-EU_R0805  [R0805]
R49  1000  R-EU_R0805  [R0805]
R50  1000  R-EU_R0805  [R0805]
R51  1k  R-EU_R0805  [R0805]
R52  10k  R-EU_R0805  [R0805]
R53  22  R-EU_R0805  [R0805]
R54  1k  R-EU_R0805  [R0805]
R55  1k  R-EU_R0805  [R0805]
R56  1000  R-EU_R0805  [R0805]
R57  1000  R-EU_R0805  [R0805]
R58  1000  R-EU_R0805  [R0805]
R59  22  R-EU_R0805  [R0805]
R60  1000  R-EU_R0805  [R0805]
R61  1k  R-EU_R0805  [R0805]
R62  100  R-EU_R0805  [R0805]
R63  1000  R-EU_R0805  [R0805]
R64  1000  R-EU_R0805  [R0805]
R65  1000  R-EU_R0805  [R0805]
R66  dnf  R-EU_R0805  [R0805]
R67  1000  R-EU_R0805  [R0805]
R68  1000  R-EU_R0805  [R0805]
R69  1k  R-EU_R0805  [R0805]
R70  1000  R-EU_R0805  [R0805]
R71  1000  R-EU_R0805  [R0805]
R72  390  R-EU_R0805  [R0805]
R73  1000  R-EU_R0805  [R0805]
R74  20k  R-EU_R0805  [R0805]
R75  330  R-EU_R0805  [R0805]
R76  100k  R-EU_R0805  [R0805]
R77  270  R-EU_R0805  [R0805]
R78  1000  R-EU_R0805  [R0805]
R79  1800  R-EU_R0805  [R0805]
R80  430  R-EU_R0805  [R0805]
R81  10  R-EU_R0805  [R0805]
R82  10  R-EU_R0805  [R0805]
R83  10  R-EU_R0805  [R0805]
R84  10  R-EU_R0805  [R0805]
R85  1000  R-EU_R0805  [R0805]
R86  1000  R-EU_R0805  [R0805]
R87  1000  R-EU_R0805  [R0805]
R88  1300  R-EU_R0805  [R0805]
R89  1300  R-EU_R0805  [R0805]
R90  150.0  R-EU_R0805  [R0805]
R91  1000  R-EU_R0805  [R0805]
R92  150.0  R-EU_R0805  [R0805]
R93  10k  R-EU_R0805  [R0805]
R94  7k32  R-EU_R0603  [R0603]
R95  5k11  R-EU_R0603  [R0603]
R96  7k32  R-EU_R0603  [R0603]
R97  7k32  R-EU_R0603  [R0603]
R98  10k  R-EU_R0805  [R0805]
R99  7k32  R-EU_R0603  [R0603]
R100  100  R-EU_R0805  [R0805]
R101  7k32  R-EU_R0603  [R0603]
R102  560  R-EU_R0805  [R0805]
R103  7k32  R-EU_R0603  [R0603]
R104  7k32  R-EU_R0603  [R0603]
R105  10k  R-EU_R0805  [R0805]
R106  22  R-EU_R0805  [R0805]
R107  10k  R-EU_R0805  [R0805]
R108  1k  R-EU_R0805  [R0805]
R109  1k  R-EU_R0805  [R0805]
R110  1k  R-EU_R0805  [R0805]
R111  1k  R-EU_R0805  [R0805]
R112  1k  R-EU_R0805  [R0805]
R113  82k  R-EU_R0805  [R0805]
R114  1000k  R-EU_R0805  [R0805]
R115  22k  R-EU_R0805  [R0805]
R116  100k  R-EU_R0805  [R0805]
TC1  MAX31855  [SOIC8]
TMP1  MCP9700  [SC70-5L]
TMP2  MCP9700  [SC70-5L]
TP_REF  TPB1,27  [B1,27]
TP_REF1  TPB1,27  [B1,27]
TRIM1  20  BOURNS_TRIMPOT  [BOURNS_TRIMPOT]
TRIM2  20  BOURNS_TRIMPOT  [BOURNS_TRIMPOT]
TRIM3  10k  BOURNS_TRIMPOT  [BOURNS_TRIMPOT]
U1  STM32F405RGT6  STM32F405RG  [TQFP64]
U$1  SN75451  [SOIC8]
U$2  POWER_BOARD_DECEL  [POWER_BOARD_DECEL]
VREF1  MAX6225ACSA+  [SOIC8]
VREG1  LT3085  [MSOP8]
X1  PN61729-S  [PN61729-S]
X2  22-23-2021  [22-23-2021]
X3  2510-  [PAK100/2500-10]
X4  W237-102  [W237-102]
Y1  32.768kHz  CRYSTAL-32.768KHZSMD-3.2X1.5  [CRYSTAL-SMD-3.2X1.5MM]
Y2  12MHz  CRYSTAL-12MHZ"  [CRYSTAL-SMD-5X3.2-4PAD]

## Nets
0: ADC_FAST_HV1_FB.4(AIN-) ADC_FAST_HV1_FB.5(GND) ADC_HV1_ELECTRODE_CURRENT.4(AIN-) ADC_HV1_ELECTRODE_CURRENT.5(GND) ADC_HV1_FG.4(AIN-) ADC_HV1_FG.5(GND) ADC_SLOW_HV1_FB.10(AVSS) ADC_SLOW_HV1_FB.11(AINN) ADC_SLOW_HV1_FB.13(REFN) ADC_SLOW_HV1_FB.17(AVSS2) ADC_TEMP_DAC_HV1_CTRL.4(AIN-) ADC_TEMP_DAC_HV1_CTRL.5(GND) BNC_DECEL_COPY.P$1(S4) BNC_DECEL_COPY.P$2(S3) BNC_DECEL_COPY.P$3(S2) BNC_DECEL_COPY.P$4(S1) C6.+ C7.- C9.2 C11.2 C12.2 C13.1 C14.1 C15.2 C16.2 C17.2 C18.2 C19.+ C20.- C21.- C22.2 C24.2 C25.2 C26.2 C28.2 C30.+ C31.- C34.2 C35.2 C37.2 C38.2 C54.1 C55.1 C57.2 C58.2 C59.2 C60.2 C61.- C62.- C63.+ C64.1 C65.1 C66.- C67.2 C69.2 C70.- C71.2 C72.2 C73.1 C75.2 C76.2 C77.2 C78.2 C79.2 C80.2 C81.2 C83.1 C85.- C86.- C87.- C90.2 C91.2 C92.2 C93.2 C94.2 C95.2 C96.2 C97.2 C98.2 C99.2 C100.2 C101.2 C102.1 C103.2 C104.2 C105.2 C106.2 C109.2 C110.- C111.2 C112.2 C113.2 C114.2 C115.2 C116.1 C118.2 C119.2 C120.2 C123.2 C124.1 C126.2 C127.2 C129.- C130.- C131.2 C132.1 C133.1 C134.2 C135.2 C136.2 C137.2 CLIP1.P$1 CLIP1.P$2 CLIP1.P$3 CLIP2.P$1 CLIP2.P$2 CLIP2.P$3 CLIP3.P$1 CLIP3.P$2 CLIP3.P$3 CLIP4.P$1 CLIP4.P$2 CLIP4.P$3 D2.1(A1) D3.1(A1) D4.1(A1) D5.1(A1) D6.1(A1) DAC_HV1_CTRL.P$14(PGND) DAC_HV1_CTRL.P$20(AGNDB) DAC_HV1_CTRL.P$21(AGNDA) DAC_HV1_CTRL.P$28(REFGND) DAC_ULTRAVOLT_CTRL.P$14(PGND) DAC_ULTRAVOLT_CTRL.P$20(AGNDB) DAC_ULTRAVOLT_CTRL.P$21(AGNDA) DAC_ULTRAVOLT_CTRL.P$28(REFGND) HV_ENABLED_LED.C HV_PSU1.J1-5(J1-5_SGND) HV_PSU2.J1-5(J1-5_SGND) IC1.3(+IN) IC1.5(+IN) IC1.10(+IN) IC1.12(+IN) IC2.3(+IN) IC2.5(+IN) IC2.10(+IN) IC3.3(+IN) IC3.5(+IN) IC4.10(+IN) IC5.3(+IN) IC5.10(+IN) IC6.12(+IN) IC9.2(-IN) IC9.6(-IN) IC9.9(-IN) IC9.13(-IN) IC10.10(+IN) IP_BNC_HV1_FB.P$1(S4) IP_BNC_HV1_FB.P$2(S3) IP_BNC_HV1_FB.P$3(S2) IP_BNC_HV1_FB.P$4(S1) IP_BNC_HV1_PSU_EXTERNAL_OFFSET.P$1(S4) IP_BNC_HV1_PSU_EXTERNAL_OFFSET.P$2(S3) IP_BNC_HV1_PSU_EXTERNAL_OFFSET.P$3(S2) IP_BNC_HV1_PSU_EXTERNAL_OFFSET.P$4(S1) K2.2(K) MUX1.P$3(GND) OP_BNC_HV1_FG_COPY.P$1(S4) OP_BNC_HV1_FG_COPY.P$2(S3) OP_BNC_HV1_FG_COPY.P$3(S2) OP_BNC_HV1_FG_COPY.P$4(S1) Q1.2(S) R23.2 R24.2 R48.1 R51.1 R68.1 R87.1 R98.1 R107.2 R114.1 R115.1 TC1.1(GND) TMP1.2(GND) TMP2.2(GND) TRIM1.P$1(A) TRIM1.P$2(S) TRIM3.P$3(E) U$2.P$15 U$2.P$16 U$2.P$18 VREF1.4(GND) ; supply symbol labelled GND
!RESET: C53.1 R42.1 U1.7(NRST) X3.10
+2.048V: C18.1 C60.1 C62.+ DAC_HV1_CTRL.P$25(REFA) DAC_HV1_CTRL.P$26(REFB) DAC_ULTRAVOLT_CTRL.P$25(REFA) DAC_ULTRAVOLT_CTRL.P$26(REFB) IC3.13(-IN) IC3.14(OUT) R15.2 R16.2 R19.2 R20.2 R43.1
+3V3_CLEAN: C87.+ C92.1 C109.1 R83.2 TMP2.4(VDD)
+12V: C80.1 C93.1 C95.1 C96.1 C104.1 C106.1 C136.1 C137.1 IC5.4(VCC) IC6.4(VCC) IC7.8(VCC) IC8.8(VCC) IC10.4(VCC) R82.1 U$2.P$29 U$2.P$30 VREG1.5(VCTRL) VREG1.7(IN) VREG1.8(IN)
+12V_CLEAN: C86.+ C91.1 C101.1 C112.1 C119.1 C120.1 IC9.4(VCC) R82.2 VREF1.2(VIN)
+24V: C12.1 C15.1 C28.1 C34.1 C37.1 C76.1 C77.1 IC1.4(VCC) IC2.4(VCC) IC3.4(VCC) IC4.4(VCC) U$2.P$33 U$2.P$34
+24V_FG: K3.24(-2:S) K3.A1 U$2.P$4 U$2.P$5 U$2.P$6
+24V_ULTRAVOLT_A: K1.14(-1:S) K1.A1 U$2.P$9 U$2.P$10
+24V_ULTRAVOLT_B: K1.24(-2:S) U$2.P$11 U$2.P$12
+A1V8: ADC_FAST_HV1_FB.2(AVDD) ADC_HV1_ELECTRODE_CURRENT.2(AVDD) ADC_HV1_FG.2(AVDD) ADC_TEMP_DAC_HV1_CTRL.2(AVDD) C25.1 C69.1 C75.1 C127.1 U$2.P$13
+A3V3: ADC_SLOW_HV1_FB.9(AVDD) C115.1 C135.1 R83.1 R100.2 TC1.4(VCC) U$2.P$25 U$2.P$26
+A5V: C2.1 C3.+ C4.1 C5.+ C7.+ C9.1 C16.1 C20.+ C31.+ C35.1 C59.1 C61.+ C79.1 DAC_HV1_CTRL.P$13(AVDD1) DAC_HV1_CTRL.P$31(AVDD2) DAC_ULTRAVOLT_CTRL.P$13(AVDD1) DAC_ULTRAVOLT_CTRL.P$31(AVDD2) MUX1.P$5(EN) MUX1.P$6(VCC) R1.1 R2.2 U$1.8(VCC) U$2.P$17
+D3V3: ADC_FAST_HV1_FB.9(SDI) ADC_FAST_HV1_FB.10(DVIO) ADC_HV1_ELECTRODE_CURRENT.9(SDI) ADC_HV1_ELECTRODE_CURRENT.10(DVIO) ADC_HV1_FG.9(SDI) ADC_HV1_FG.10(DVIO) ADC_SLOW_HV1_FB.22(DVDD) ADC_TEMP_DAC_HV1_CTRL.9(SDI) ADC_TEMP_DAC_HV1_CTRL.10(DVIO) C1.1 C8.+ C10.1 C23.1 C27.1 C32.+ C33.1 C36.1 C40.1 C47.1 C68.1 C74.1 C122.1 C125.1 DAC_HV1_CTRL.P$12(DVCC) DAC_HV1_CTRL.P$32(BIN_2CMP) DAC_ULTRAVOLT_CTRL.P$12(DVCC) DAC_ULTRAVOLT_CTRL.P$32(BIN_2CMP) F_RX1.P$2 JP1.5 JP1.6 R3.1 R10.1 R32.1 R42.2 R44.1 R105.2 U1.19(VDD1) U1.32(VDD2) U1.42(PA9/UART1_TX) U1.43(PA10/UART1_RX) U1.48(VDD3) U1.64(VDD4) U$2.P$35 U$2.P$36 X2.1 X3.3 X3.4
+D3V3_CLEAN: C46.1 C48.1 C49.1 C51.+ R44.2 U1.13(VDDA)
-12V: C13.2 C14.2 C24.1 C54.2 C55.2 C64.2 C65.2 C73.2 C83.2 C94.1 C97.1 C132.2 C133.2 IC1.11(GND) IC2.11(GND) IC3.11(GND) IC4.11(GND) IC5.11(GND) IC6.11(GND) IC7.4(GND) IC8.4(GND) IC10.11(GND) R81.1 U$2.P$27 U$2.P$28
-12V_CLEAN: C85.+ C90.1 C100.1 C111.1 IC9.11(GND) R81.2
-A5V: C6.- C11.1 C17.1 C19.- C30.- C38.1 C58.1 C63.- DAC_HV1_CTRL.P$15(AVSS1) DAC_HV1_CTRL.P$30(AVSS2) DAC_ULTRAVOLT_CTRL.P$15(AVSS1) DAC_ULTRAVOLT_CTRL.P$30(AVSS2) U$2.P$14
BOOT0: R116.2 U1.60(BOOT0) X2.2
CS_ADC_FAST_HV1_FB: ADC_FAST_HV1_FB.6(CNVST) U1.37(PC6/I2S2_MCK)
CS_ADC_HV1_ELECTRODE_CURRENT: ADC_HV1_ELECTRODE_CURRENT.6(CNVST) U1.17(PA3/UART2_RX)
CS_ADC_HV1_FG: ADC_HV1_FG.6(CNVST) U1.22(PA6/SPI1_MISO)
CS_ADC_SLOW_HV1_FB: ADC_SLOW_HV1_FB.23(CSB) U1.33(PB12/I2S2_WS)
CS_ADC_TEMP_DAC_HV1_CTRL: ADC_TEMP_DAC_HV1_CTRL.6(CNVST) U1.54(PD2/SDIO_CMD)
CS_DISPLAY: JP1.4 U1.26(PB0)
CS_TC_RES_STACK: TC1.6(!CS) U1.38(PC7)
GAIN_A: MUX1.P$10(A1) U1.21(PA5/SPI1_SCK)
GAIN_B: MUX1.P$1(A0) U1.20(PA4/SPI1_NSS)
GND: ADC_SLOW_HV1_FB.3(DGND) ADC_SLOW_HV1_FB.4(SYNC) ADC_SLOW_HV1_FB.20(DGND) C1.2 C2.2 C3.- C4.2 C5.- C8.- C10.2 C23.2 C27.2 C29.2 C32.- C33.2 C36.2 C39.2 C40.2 C41.2 C43.2 C44.2 C46.2 C47.2 C48.2 C49.2 C50.2 C51.- C53.2 C68.2 C74.2 C122.2 C125.2 DAC_HV1_CTRL.P$5(!CLR) DAC_HV1_CTRL.P$6(!LDAC) DAC_HV1_CTRL.P$11(DGND) DAC_ULTRAVOLT_CTRL.P$5(!CLR) DAC_ULTRAVOLT_CTRL.P$6(!LDAC) DAC_ULTRAVOLT_CTRL.P$11(DGND) F_RX1.P$3 F_RX1.P$7 F_TX1.P$1 F_TX1.P$3(CATHODE) F_TX1.P$4 F_TX1.P$5 F_TX1.P$8 JP1.7 JP1.8 LED1.C LED2.C LED3.C R7.1 R116.1 U1.12(VSSA) U1.18(VSS1) U1.28(PB2-BOOT1) U1.63(VSS2) U$1.4(GND) U$2.P$19 U$2.P$20 U$2.P$21 U$2.P$22 U$2.P$23 U$2.P$24 U$2.P$31 U$2.P$32 X1.4 X1.S1 X1.S2 X3.7 X3.8
HV1_COARSE_CTRL: IC3.8(OUT) R37.1 R45.1
HV1_CTRL: C88.+ C89.1 CONN1.P$7 CONN1.P$17 R84.2
HV1_CURRENT_MON: IC4.3(+IN) IC6.8(OUT) R75.1 R78.1 R80.1
HV1_FB: IC10.3(+IN) IP_BNC_HV1_FB.P$5(S)
HV1_FB_BUFF: IC4.12(+IN) IC10.1(OUT) IC10.2(-IN) IC10.5(+IN) R109.2 R112.1
HV1_FB_LPF: IC10.13(-IN) IC10.14(OUT) R111.1
HV1_FG: CONN1.P$9 CONN1.P$10 CONN1.P$19 CONN1.P$20 IC8.3(+IN) IC8.6(-IN) K2.3(DS2) R93.2 U$2.P$1 U$2.P$2 U$2.P$3
HV1_FG_UNBUFF: C42.- C45.2 C52.- C56.2 C82.- C84.2 C88.- C89.2 IC5.8(OUT) IC7.5(+IN) IC8.5(+IN) R34.1 R52.2 R57.2
HV1_FINE_CTRL: DAC_HV1_CTRL.P$19(VOUTB) R70.2 R71.2
HV_ENABLE: FRONT_PANEL_INTERLOCK.2 HV_PSU1.J1-4(J1-4_EN) HV_PSU2.J1-4(J1-4_EN) Q1.1(G) R7.2 R8.1 R9.2 R24.1 R102.1
HV_ENABLE_RETURN: D1.2(C2) U1.50(PA15/JTDI)
HV_ENABLE_SOFTWARE: EXT_INTERLOCK.1 U1.52(PC11/SDIO_D3)
LED_1: R6.1 U1.39(PC8/SDIO_D0)
LED_2: R5.1 U1.40(PC9/SDIO_D1)
LED_3: R4.1 U1.41(PA8)
N$1: IC9.8(OUT) R96.1 R97.2 R101.1
N$2: C114.1 VREF1.3(NR)
N$3: IC9.12(+IN) R101.2 R103.1
N$4: C118.1 R104.1 TRIM3.P$1(A) VREF1.6(OUT)
N$5: IC10.8(OUT) IC10.9(-IN)
N$6: DAC_ULTRAVOLT_CTRL.P$22(VOUTA) R17.2
N$7: K1.A2 Q1.3(D)
N$8: CONN1.P$5 CONN1.P$15 K3.11(-1:P)
N$9: C117.1 C121.1 IC9.3(+IN) R96.2 R104.2
N$10: C117.2 C121.2 IC9.1(OUT) R99.1
N$11: IC4.2(-IN) R56.1 R58.2 R62.2 R63.2 R64.2
N$12: C107.1 C108.1 IC9.5(+IN) R95.1 R99.2
N$13: IC9.10(+IN) R94.2 R97.1
N$14: C102.2 C107.2 C108.2 IC9.7(OUT) R94.1 R95.2
N$15: IC1.6(-IN) R13.2 R14.1 R15.1 R16.1
N$16: D5.3(C1A2) R106.2 R108.1
N$17: ADC_FAST_HV1_FB.3(AIN+) C123.1 R106.1
N$18: R108.2 R109.1
N$19: EXT_INTERLOCK.2 LID1_INTERLOCK.1
N$20: LID1_INTERLOCK.2 LID2_INTERLOCK.1
N$21: FRONT_PANEL_INTERLOCK.1 LID2_INTERLOCK.2
N$22: D1.1(A1) D1.3(C1A2) R8.2
N$23: C134.1 IC10.12(+IN) R112.2
N$24: CONN1.P$6 CONN1.P$16 K3.14(-1:S)
N$25: IC1.2(-IN) R17.1 R18.2 R19.1 R20.1
N$26: IC2.13(-IN) R23.1 R25.2
N$27: IC1.1(OUT) R18.1 R22.2
N$28: IC1.7(OUT) R12.2 R13.1
N$29: ADC_SLOW_HV1_FB.12(AINP) C116.2 D6.3(C1A2) R110.2
N$30: IC1.9(-IN) R11.2 R12.1
N$31: ADC_SLOW_HV1_FB.19(CLK) R107.1
N$32: ADC_SLOW_HV1_FB.16(CAPP) C128.2
N$33: ADC_SLOW_HV1_FB.15(CAPN) C128.1
N$34: ADC_SLOW_HV1_FB.21(CAPREG) C131.1
N$35: IC6.2(-IN) R90.1 R91.2
N$36: K2.4(DS1) K3.A2
N$37: HV_ENABLED_LED.A R9.1
N$38: IC1.13(-IN) R21.2 R22.1
N$39: DAC_ULTRAVOLT_CTRL.P$19(VOUTB) R14.2
N$40: CONN1.P$2 CONN1.P$12 K3.21(-2:P)
N$41: HV_PSU1.J1-2(J1-2_VIN) HV_PSU1.J1-9(J1-9_VIN) K1.21(-2:P)
N$42: K2.1(A) R102.2
N$43: HV_PSU2.J1-2(J1-2_VIN) HV_PSU2.J1-9(J1-9_VIN) K1.11(-1:P)
N$44: R88.1 R90.2
N$46: IC6.6(-IN) R91.1 R92.2
N$47: R89.2 R92.1
N$48: IC6.7(OUT) R86.2 R89.1
N$49: IC6.1(OUT) R85.2 R88.2
N$50: IC6.10(+IN) R86.1 R87.2
N$51: IC6.9(-IN) R78.2 R85.1
N$53: IC7.6(-IN) IC7.7(OUT) OP_BNC_HV1_FG_COPY.P$5(S)
N$54: TRIM3.P$2(S) VREF1.5(TRIM)
N$55: IC10.6(-IN) R113.1 R114.2 R115.2
N$56: IC6.5(+IN) IC7.1(OUT) IC7.2(-IN)
N$57: IC6.3(+IN) IC8.1(OUT) IC8.2(-IN)
N$59: C39.1 U1.3(PC14) Y1.P$2
N$60: C113.1 R100.1 TMP1.4(VDD)
N$61: IC7.3(+IN) IC8.7(OUT) R93.1
N$62: MUX1.P$2(S1) R63.1
N$63: IC4.1(OUT) R56.2 R65.2
N$64: IC4.14(OUT) R49.2 R50.1
N$65: IC4.5(+IN) R49.1 R68.2
N$66: IC4.6(-IN) R60.2 R65.1
N$67: D3.3(C1A2) R53.2 R55.1
N$68: ADC_HV1_ELECTRODE_CURRENT.3(AIN+) C71.1 R53.1
N$69: IC4.7(OUT) R54.2 R60.1
N$70: MUX1.P$9(S2) R58.1
N$71: C41.1 U1.4(PC15) Y1.P$1
N$72: C50.1 U1.6(PH1) Y2.3
N$73: C44.1 U1.5(PH0) Y2.1
N$74: C29.1 U1.47(VCAP2)
N$75: MUX1.P$4(S3) R64.1
N$76: C43.1 U1.31(VCAP1)
N$77: LED3.A R6.2
N$78: MUX1.P$7(S4) R62.1
N$79: R30.2 U1.44(PA11)
N$80: IC4.13(-IN) MUX1.P$8(D1) R50.2
N$81: R29.2 U1.45(PA12)
N$82: R1.2 U$1.1(1A)
N$83: IC4.8(OUT) IC4.9(-IN)
N$84: F_TX1.P$2(ANODE) F_TX1.P$6(ANODE) F_TX1.P$7(ANODE) R2.1 U$1.3(1Y)
N$85: LED2.A R5.2
N$86: LED1.A R4.2
N$87: IC2.1(OUT) IC2.2(-IN)
N$88: IC2.6(-IN) IC2.7(OUT)
N$89: IC2.8(OUT) IC2.9(-IN)
N$90: IC6.13(-IN) R77.2 R79.1
N$91: R77.1 R80.2
N$92: IC6.14(OUT) R76.1 R79.2
N$93: C81.1 IC5.5(+IN) R76.2
N$94: IC5.6(-IN) IC5.7(OUT) R73.1
N$96: R74.1 R75.2
N$97: IC5.2(-IN) R72.1 R74.2
N$98: IC5.1(OUT) R67.1 R72.2
N$101: DAC_HV1_CTRL.P$22(VOUTA) R39.2
N$103: IC3.2(-IN) R34.2 R35.1 R37.2
N$110: IC3.12(+IN) R47.1 R48.2
N$115: ADC_TEMP_DAC_HV1_CTRL.3(AIN+) C26.1 R26.1
N$120: DAC_HV1_CTRL.P$29(TEMP) R28.2
N$121: C57.1 IC3.10(+IN) R41.1 R43.2
N$122: R39.1 R41.2
N$123: IC3.9(-IN) R40.1 R45.2
N$124: IC5.9(-IN) R57.1 R66.1 R67.2 R70.1 R71.1 R73.2
N$125: R110.1 R111.2
N$127: IC3.6(-IN) R31.2 R36.1
N$128: IC3.1(OUT) R31.1 R35.2
N$142: IC3.7(OUT) R33.1 R36.2
N$143: C52.+ C56.1 R38.2 R46.1
N$144: C42.+ C45.1 R33.2 R38.1
N$145: C82.+ C84.1 R46.2 R84.1
N$146: IP_BNC_HV1_PSU_EXTERNAL_OFFSET.P$5(S) R66.2
N$148: IC5.13(-IN) IC5.14(OUT) R69.2
N$149: IC5.12(+IN) R51.2 R52.1
N$166: R54.1 R55.2
N$167: D2.3(C1A2) R26.2 R27.1
N$168: R27.2 R28.1
N$178: BNC_DECEL_COPY.P$5(S) IC10.7(OUT) R113.2
N$179: R40.2 TRIM1.P$3(E)
N$180: R47.2 TRIM2.P$1(A) TRIM2.P$2(S)
N$183: D4.3(C1A2) R59.2 R61.1
N$184: ADC_HV1_FG.3(AIN+) C78.1 R59.1
N$189: R61.2 R69.1
RDY_ADC_SLOW_HV1_FB: ADC_SLOW_HV1_FB.18(RDYB) U1.23(PA7/SPI1_MOSI)
RST_ADC_SLOW_HV1_FB: ADC_SLOW_HV1_FB.5(RSTB) R105.1
RST_DAC_HV1_CTRL: DAC_HV1_CTRL.P$10(!RSTIN) R32.2
RST_DAC_ULTRAVOLT_CTRL: DAC_ULTRAVOLT_CTRL.P$10(!RSTIN) R10.2
SPI0_MISO: ADC_FAST_HV1_FB.7(SDO) ADC_HV1_ELECTRODE_CURRENT.7(SDO) ADC_HV1_FG.7(SDO) ADC_SLOW_HV1_FB.2(DOUT) JP1.1 TC1.7(SO) U1.35(PB14/I2S2_XD)
SPI0_MOSI: ADC_SLOW_HV1_FB.1(DIN) JP1.3 U1.36(PB15/I2S2_SD)
SPI0_SCLK: ADC_FAST_HV1_FB.8(SCLK) ADC_HV1_ELECTRODE_CURRENT.8(SCLK) ADC_HV1_FG.8(SCLK) ADC_SLOW_HV1_FB.24(SCLK) JP1.2 TC1.5(SCK) U1.34(PB13/I2S2_CK)
SPI1_MISO: ADC_TEMP_DAC_HV1_CTRL.7(SDO) DAC_HV1_CTRL.P$4(SDO) DAC_ULTRAVOLT_CTRL.P$4(SDO) U1.56(PB4/JTRST)
SPI1_MOSI: DAC_HV1_CTRL.P$3(SDIN) DAC_ULTRAVOLT_CTRL.P$3(SDIN) U1.57(PB5)
SPI1_SCLK: ADC_TEMP_DAC_HV1_CTRL.8(SCLK) DAC_HV1_CTRL.P$2(SCLK) DAC_ULTRAVOLT_CTRL.P$2(SCLK) U1.55(PB3/JTDO)
SWCLK: U1.49(PA14/JTCK) X3.5
SWDIO: U1.46(PA13/JTMS) X3.9
SYNC_DAC_HV1_CTRL: DAC_HV1_CTRL.P$1(!SYNC) U1.58(PB6)
SYNC_DAC_ULTRAVOLT_CTRL: DAC_ULTRAVOLT_CTRL.P$1(!SYNC) U1.53(PC12/SDIO_CLK)
T+: TC1.3(T+) X4.1
T-: TC1.2(T-) X4.2
TEMP_MON_ADC_FB: TMP1.3(VOUT) U1.24(PC4)
TEMP_MON_VREF: TMP2.3(VOUT) U1.25(PC5)
UART_RX: F_RX1.P$6 R3.2 U1.30(PB11)
UART_TX: U1.29(PB10) U$1.2(1B)
ULTRAVOLT_GND: HV_PSU1.J1-1(J1-1_GND) HV_PSU1.J1-8(J1-8_GND) HV_PSU2.J1-1(J1-1_GND) HV_PSU2.J1-8(J1-8_GND) U$2.P$7 U$2.P$8
USB_D+: R29.1 X1.3
USB_D-: R30.1 X1.2
VPROG_ULTRAVOLT_A: HV_PSU2.J1-6(J1-6_VPROG) IC1.14(OUT) R21.1
VPROG_ULTRAVOLT_B: HV_PSU1.J1-6(J1-6_VPROG) IC1.8(OUT) R11.1
VREF: ADC_FAST_HV1_FB.1(VREF) ADC_HV1_ELECTRODE_CURRENT.1(VREF) ADC_HV1_FG.1(VREF) ADC_SLOW_HV1_FB.14(REFP) ADC_TEMP_DAC_HV1_CTRL.1(VREF) C21.+ C22.1 C66.+ C67.1 C70.+ C72.1 C98.1 C99.1 C124.2 C126.1 C129.+ C130.+ IC2.12(+IN) IC9.14(OUT) R103.2 TP_REF1.TP TP_REF.TP TRIM2.P$3(E) VREG1.4(SET)
VREF_5V: HV_PSU1.J1-7(J1-7_VREF) HV_PSU1.J1-13(J1-13_IPROG) HV_PSU2.J1-7(J1-7_VREF) HV_PSU2.J1-13(J1-13_IPROG) IC2.14(OUT) R25.1
VREF_TOUGH_BUFF: C103.1 C105.1 C110.+ D2.2(C2) D3.2(C2) D4.2(C2) D5.2(C2) D6.2(C2) R98.2 VREG1.1(OUT) VREG1.2(OUT) VREG1.3(OUT) VREG1.BOTTOM(OUT)
VUSB: X1.1
Unconnected: ADC_SLOW_HV1_FB.6(GPIO3) ADC_SLOW_HV1_FB.7(GPIO2) ADC_SLOW_HV1_FB.8(GPIO1) CONN1.P$1 CONN1.P$3 CONN1.P$4 CONN1.P$8 CONN1.P$11 CONN1.P$13 CONN1.P$14 CONN1.P$18 DAC_HV1_CTRL.P$7(D0) DAC_HV1_CTRL.P$8(D1) DAC_HV1_CTRL.P$9(!RSTOUT) DAC_HV1_CTRL.P$16(ISCC) DAC_ULTRAVOLT_CTRL.P$7(D0) DAC_ULTRAVOLT_CTRL.P$8(D1) DAC_ULTRAVOLT_CTRL.P$9(!RSTOUT) DAC_ULTRAVOLT_CTRL.P$16(ISCC) DAC_ULTRAVOLT_CTRL.P$29(TEMP) HV_PSU1.J1-3(J1-3_IMON) HV_PSU1.J1-10(J1-10_NC) HV_PSU1.J1-11(J1-11_IMODE) HV_PSU1.J1-12(J1-12_VMODE) HV_PSU1.J1-14(J1-14_VMON) HV_PSU1.J2-1(J2-1_HVRET) HV_PSU1.J2-2(J2-2_HVRET) HV_PSU2.J1-3(J1-3_IMON) HV_PSU2.J1-10(J1-10_NC) HV_PSU2.J1-11(J1-11_IMODE) HV_PSU2.J1-12(J1-12_VMODE) HV_PSU2.J1-14(J1-14_VMON) HV_PSU2.J2-1(J2-1_HVRET) HV_PSU2.J2-2(J2-2_HVRET) J1.1 J1.2 J1.3 J1.4 K1.12(-1:O) K1.22(-2:O) K3.12(-1:O) K3.22(-2:O) U1.1(VBAT) U1.2(PC13) U1.8(PC0) U1.9(PC1) U1.10(PC2) U1.11(PC3) U1.14(PA0) U1.15(PA1) U1.16(PA2/UART2_TX) U1.27(PB1) U1.51(PC10/SDIO_D2) U1.59(PB7) U1.61(PB8) U1.62(PB9) U$1.5(2Y) U$1.6(2A) U$1.7(2B) X3.1 X3.2 X3.6

## Buses
B$1
B$2
B$4
B$5
B$6

## Notes on the sheet
- HV1 Feedback Digitiser and Analog Monitor Outputs
- First order LPF, 16Hz
  For removing noise and anti-aliasing
- Unity Gain Buffer
- HV1 Beam Compensation, Floating Ground (FG) Synthesis
- RS: 192-3172
- Monitors DC component of lens
  voltage at very low sample rate
- JFET buffers
  need guard rings
- Differential, gain 3.9
- Add some extra signal, so that the accel
  source can add some fast transients if
  needed to counteract source fluctuations
- Gain = - 2.571 | RC filter, matching HV filter
- these cause large error
- Voltage Reference
- Also use plastic enclosure to prevent temperature convection flows across the circuit. 
  This means temperature across the circuit is uniform and slow-changing, making it easier to compensate.
- Temperature monitor to enable software compensation of temperature drift
- This signal matches the error induced by the beam 
  current striking the decel lens and high voltage RC filter
  It is summed with the "fine HV control" offset signal (-8.192V to +8.192V)
- Sum RC-filtered and non-filtered signals
- Gain = - 1/52.13
- ADC_SLOW_HV1 digitises a filtered version of HV1 feedback signal at a low sample rate but at high accuracy.
  
  ADC_FAST_HV1 digitises HV1 feedback signal at a high sample rate but at low accuracy.
- S02-20150300
- Temperature monitor to enable software compensation of temperature drift
- Metal EMI shield to reduce noise and spread thermal fluctuations
- RT0603BRD075K11L
- CPF0603B7K32E1
- TACL225M016XTA
- Low pass filter 0.5Hz to reduce noise (including 0.1-10Hz)
- Decel Voltage (0-10V for 0-20kV) | HV1 Control Signal Synthesiser - Dual High Precision DAC
- High stability voltage reference | Gain = 4.809
- ALL INPUTS ARE REVERSED!
- These op-amps should be +26V -12V
- HV1 Coarse Control Signal
  GND referenced, 0-10V
- this is not working?
- Low-Pass filter for the HV1 control signal
- -4096V to +4.096V
- Sums the 0-10V control signal with the HV1 floating ground offset,
  so that it is referenced appropriately.
- Tune to get accurate 0-10V
  from opamp output
- Digital Interface and Daughter Connections
- Fine HV Control (HP020 offset)
- -4096V to +4.096V
- This analogue voltage can provide fine tuning of the 
  HV PSU Floating Offset so that the lens voltage can
  be controlled to higher resolution than with the 
  coarse control alone.
- DAC temperature reading
- 5Mbps Fibre Optic Link
- 3V3 UART Rx 
  Signal Out
- HV1 Electrode Current Measurement
- 3V3 UART Tx Signal In
- HV_ENABLE activates the photoMOS and
  thus the relay K1, which then connects
  pins 5 & 6 of HP020PIP020 together, as
  well as connecting power to the device
- Electrode Current Digitiser
  HV1 Power Supply Current - Feedback Resistor Stack Current = Electrode Current
  
  Sampled at 1Msps and results integrated and stored digitally
- STM32F405
- VDD Range: 1.8 - 3.6V
- Range selectable in software via these digital inputs
- Gain can vary from 1 to 1000
- Reset
- -4096V to +4.096V
- -4096V to +4.096V

## Library data of the parts
ADC_FAST_HV1_FB ADC_HV1_ELECTRODE_CURRENT ADC_HV1_FG ADC_TEMP_DAC_HV1_CTRL = josh:MCP33131: MCP33131 16-bit SAR ADC
ADC_SLOW_HV1_FB = josh:MAX11270: MAX11270EUG+ MAX11270 24-bit ADC https://docs.rs-online.com/b7ae/A700000006824159.pdf
BNC_DECEL_COPY IP_BNC_HV1_FB IP_BNC_HV1_PSU_EXTERNAL_OFFSET OP_BNC_HV1_FG_COPY = josh:BNC_RS: BNC RS 546-4516
C1 C2 C4 C9-C18 C22-C26 C28 C34-C38 C45 C54-C60 C64 C65 C67-C69 C71-C81 C83 C84 C89-C109 C111-C128 C131-C137 = rcl:C-EU: CAPACITOR, European symbol; SPICEPREFIX: C
C3 C5-C8 C19-C21 C30-C32 C42 C51 C52 C61-C63 C66 C70 C82 C85-C88 C110 C129 C130 = rcl:CPOL-EU: POLARIZED CAPACITOR, European symbol; SPICEPREFIX: C
C27 C33 C40 C47 C53 = SparkFun-Capacitors:0.1UF: 0.1µF ceramic capacitors A capacitor is a passive two-terminal electrical component used to store electrical energy temporarily in an electric field.; PROD_ID: CAP-15083
C29 C43 = SparkFun-Capacitors:2.2UF: 2.2µF ceramic capacitors A capacitor is a passive two-terminal electrical component used to store electrical energy temporarily in an electric field.; PROD_ID: CAP-14232
C39 C41 = SparkFun-Capacitors:15PF: 15pF ceramic capacitors A capacitor is a passive two-terminal electrical component used to store electrical energy temporarily in an electric field.; PROD_ID: CAP-13063
C44 C50 = SparkFun-Capacitors:22PF: 22pF ceramic capacitors A capacitor is a passive two-terminal electrical component used to store electrical energy temporarily in an electric field.; PROD_ID: CAP-14674
C46 = SparkFun-Capacitors:0.1UF: 0.1µF ceramic capacitors A capacitor is a passive two-terminal electrical component used to store electrical energy temporarily in an electric field.; PROD_ID: CAP-15083; SPICEPREFIX: C
C48 = SparkFun-Capacitors:1.0UF: 1µF ceramic capacitors A capacitor is a passive two-terminal electrical component used to store electrical energy temporarily in an electric field.; PROD_ID: CAP-12417; SPICEPREFIX: C
C49 = SparkFun-Capacitors:4.7UF: 4.7µF ceramic capacitors A capacitor is a passive two-terminal electrical component used to store electrical energy temporarily in an electric field.; PROD_ID: CAP-14240; SPICEPREFIX: C
CLIP1-CLIP4 = josh:RFI_SHIELD_CLIP: Harwin RFI Shield Clip https://docs.rs-online.com/97ab/0900766b8148a2a0.pdf RS# 909-4473
CONN1 = josh:PSU_CONNECTOR: PSU Connector for HP020PIP020
D1-D6 = diode:BAS40-04: Silicon Schottky Diodes General-purpose diode for high-speed switching
DAC_HV1_CTRL DAC_ULTRAVOLT_CTRL = josh:AD5763: AD5763 Dual DAC Complete Dual, 16-Bit High Accuracy Digital Analogue Converter https://docs.rs-online.com/55b3/0900766b8131b814.pdf
EXT_INTERLOCK FRONT_PANEL_INTERLOCK LID1_INTERLOCK LID2_INTERLOCK = con-molex:KK-156-2: KK 156 HEADER Source: http://www.molex.com/pdm_docs/sd/026604100_sd.pdf; MF: MOLEX; OC_FARNELL: unknown; OC_NEWARK: unknown
F_RX1 = josh:HFBR-2412-TZ: HFBR-2412-TZ Fibre Optic Receiver <=160Mbps https://www.mouser.co.uk/datasheet/2/678/AV02-0176EN_2019-02-15-1827546.pdf
F_TX1 = josh:HFBR-1412-TZ: HFBR-1412-TZ Fibre Optic Transmitter <=160Mbps https://www.mouser.co.uk/datasheet/2/678/AV02-0176EN_2019-02-15-1827546.pdf
HV_ENABLED_LED LED1-LED3 = adafruit:LED: LED OSRAM: - CHIPLED LG R971, LG N971, LY N971, LG Q971, LY Q971, LO R971, LY R971 LH N974, LH R974 LS Q976, LO Q976, LY Q976 LO Q996 - Hyper CHIPLED LW Q18S LB Q993, LB Q99A, LB R99A - SideLED LS A670, LO A670, LY A670, LG A670, LP A670 LB A673, LV A673, LT A673, LW A673 LH A674 LY A675 LS A676, LA A676, LO A676, LY A676, LW A676 LS A679, LY A679, LG A679 - Hyper Micro SIDELED® LS Y876, LA Y876, LO Y876, LY Y876 LT Y87S - SmartLED LW L88C, LW L88S LB L89C, LB L89S, LG L890 LS L89K, LO L89K, LY L89K LS L896, LA L896, LO L896, LY L896 - TOPLED LS T670, LO T670, LY T670, LG T670, LP T670 LSG T670, LSP T670, LSY T670, LOP T670, LYG T670 LG T671, LOG T671, LSG T671 LB T673, LV T673, LT T673, LW T673 LH T674 LS T676, LA T676, LO T676, LY T676, LB T676, LH T676, LSB T676, LW T676 LB T67C, LV T67C, LT T67C, LS T67K, LO T67K, LY T67K, LW E67C LS E67B, LA E67B, LO E67B, LY E67B, LB E67C, LV E67C, LT E67C LW T67C LS T679, LY T679, LG T679 LS T770, LO T770, LY T770, LG T770, LP T770 LB T773, LV T773, LT T773, LW T773 LH T774 LS E675, LA E675, LY E675, LS T675 LS T776, LA T776, LO T776, LY T776, LB T776 LHGB T686 LT T68C, LB T68C - Hyper Mini TOPLED® LB M676 - Mini TOPLED Santana® LG M470 LS M47K, LO M47K, LY M47K Source: http://www.osram.convergy.de/
HV_PSU1 HV_PSU2 = josh:ULTRAVOLT_20A: Ultravolt 20A High Voltage Power Supply
IC1-IC6 IC9 IC10 = josh:ADA4522-4: ADA4522-4 Quad Op-amp opamp
IC7 IC8 = josh:AD8034: FastFET Dual Op-Amp AD8034 https://docs.rs-online.com/2e5c/A700000008016360.pdf https://uk.rs-online.com/web/p/op-amps/2264473 RS: 226-4473
J1 = con-amp:MTA04-156: AMP connector
JP1 = adafruit:PINHD-1X8: PIN HEADER
K1 K3 = relay:FINDER-30.22: SUBMINIATURE DIL-RELAIS FINDER 30.22.9.024.0000 Kontakt max. AC - 125V Distributor: Farnell Bestell Nr.: 1217371 Source: http://www.farnell.com/datasheets/87634.pdf; OC_FARNELL: unknown; OC_NEWARK: unknown
K2 = relay:AQY*: PhotoMOS Relay NAiS Source: http://www.panasonic-electric-works.com/catalogues/downloads/photomos/ds_x615_en_aqz10_20.pdf; OC_FARNELL: unknown; OC_NEWARK: unknown
MUX1 = josh:TMUX1104: TMUX1104 4-1 Multiplexer
Q1 = adafruit:MOSFET-N: N-Channel Mosfet 2N7002E - 60V 260mA SOT23 [Digikey: 2N7002ET1GOSTR-ND] - REEL BSH103 - 30V 850mA SOT23 [Digikey: 568-5013-1-ND]
R1-R28 R31-R41 R43-R116 = rcl:R-EU_: RESISTOR, European symbol; SPICEPREFIX: R
R29 R30 = SparkFun-Resistors:22OHM: 22Ω resistor A resistor is a passive two-terminal electrical component that implements electrical resistance as a circuit element. Resistors act to reduce current flow, and, at the same time, act to lower voltage levels within circuits. - Wikipedia; PROD_ID: RES-12427
R42 = SparkFun-Resistors:5.1KOHM; PROD_ID: RES-14340
TC1 = josh:MAX31855: MAX31855 Thermocouple Interface
TMP1 TMP2 = josh:MCP9700
TP_REF TP_REF1 = testpad:TP: Test pad
TRIM1-TRIM3 = josh:BOURNS_TRIMPOT: Bourns Trimpot Trim Potentiometer
U1 = STM32_Temp:STM32F405RG: STM32F405RGT6 ARM DSP Chip used on the WAV Trigger board. IC MCU 32BIT 1MB FLASH 64LQFP Datasheet <https://cdn.sparkfun.com/datasheets/Widgets/STM32F405RGT6.pdf> SparkFun Products WAV Trigger <https://www.sparkfun.com/products/13660> (WIG-13660); PROD_ID: IC-11709
U$1 = josh:SN75451
U$2 = josh:POWER_BOARD_DECEL
VREF1 = josh:MAX6225ACSA+: MAX6225ACSA+ Voltage Reference 2.500V MAX6225
VREG1 = josh:LT3085: LT3085 Linear Voltage Regulator LT3085EMS8E#PBF
X1 = con-berg:PN61729-S: BERG USB connector; OC_FARNELL: unknown; OC_NEWARK: unknown
X2 = con-molex:22-23-2021: .100" (2.54mm) Center Header - 2 Pin; MF: MOLEX; MPN: 22-23-2021; OC_FARNELL: 1462926; OC_NEWARK: 25C3832
X3 = con-3m:2510-: 3M (TM) Pak 100 4-Wall Header Source: 3M; MF: 3M; MPN: 2510-6002UB; OC_FARNELL: 9838244; OC_NEWARK: 46F4725
X4 = con-wago-500:W237-102: WAGO SCREW CLAMP; MPN: 237-102; OC_FARNELL: unknown; OC_NEWARK: 70K9898
Y1 = SparkFun-Clocks:CRYSTAL-32.768KHZ: 32.768kHz Crystal Frequency: 32.768kHz Frequency Stability: ±20ppm Load Capacitance: 12.5pF (PTH-2X6 & SMD-3.2X1.5), 6pF (SMD-2X6) SparkFun Products: SparkFun BigTime Watch Kit <https://www.sparkfun.com/products/11734> SparkFun nRF52832 Breakout <https://www.sparkfun.com/products/13990> SparkFun Real Time Clock Module <https://www.sparkfun.com/products/12708>; PROD_ID: XTAL-13062
Y2 = SparkFun-Clocks:CRYSTAL-12MHZ: 12.0MHz Crystal Frequency: 12.0MHz Frequency Tolerance: ±20ppm Load Capacitance: 18pF SparkFun Products: SparkFun Logomatic <https://www.sparkfun.com/products/12772> Pocket AVR Programmer <https://www.sparkfun.com/products/9825>; PROD_ID: XTAL-08297